# EAGLE board ArduSatPayloadModule (EAGLE 6.3), part 1 of 2
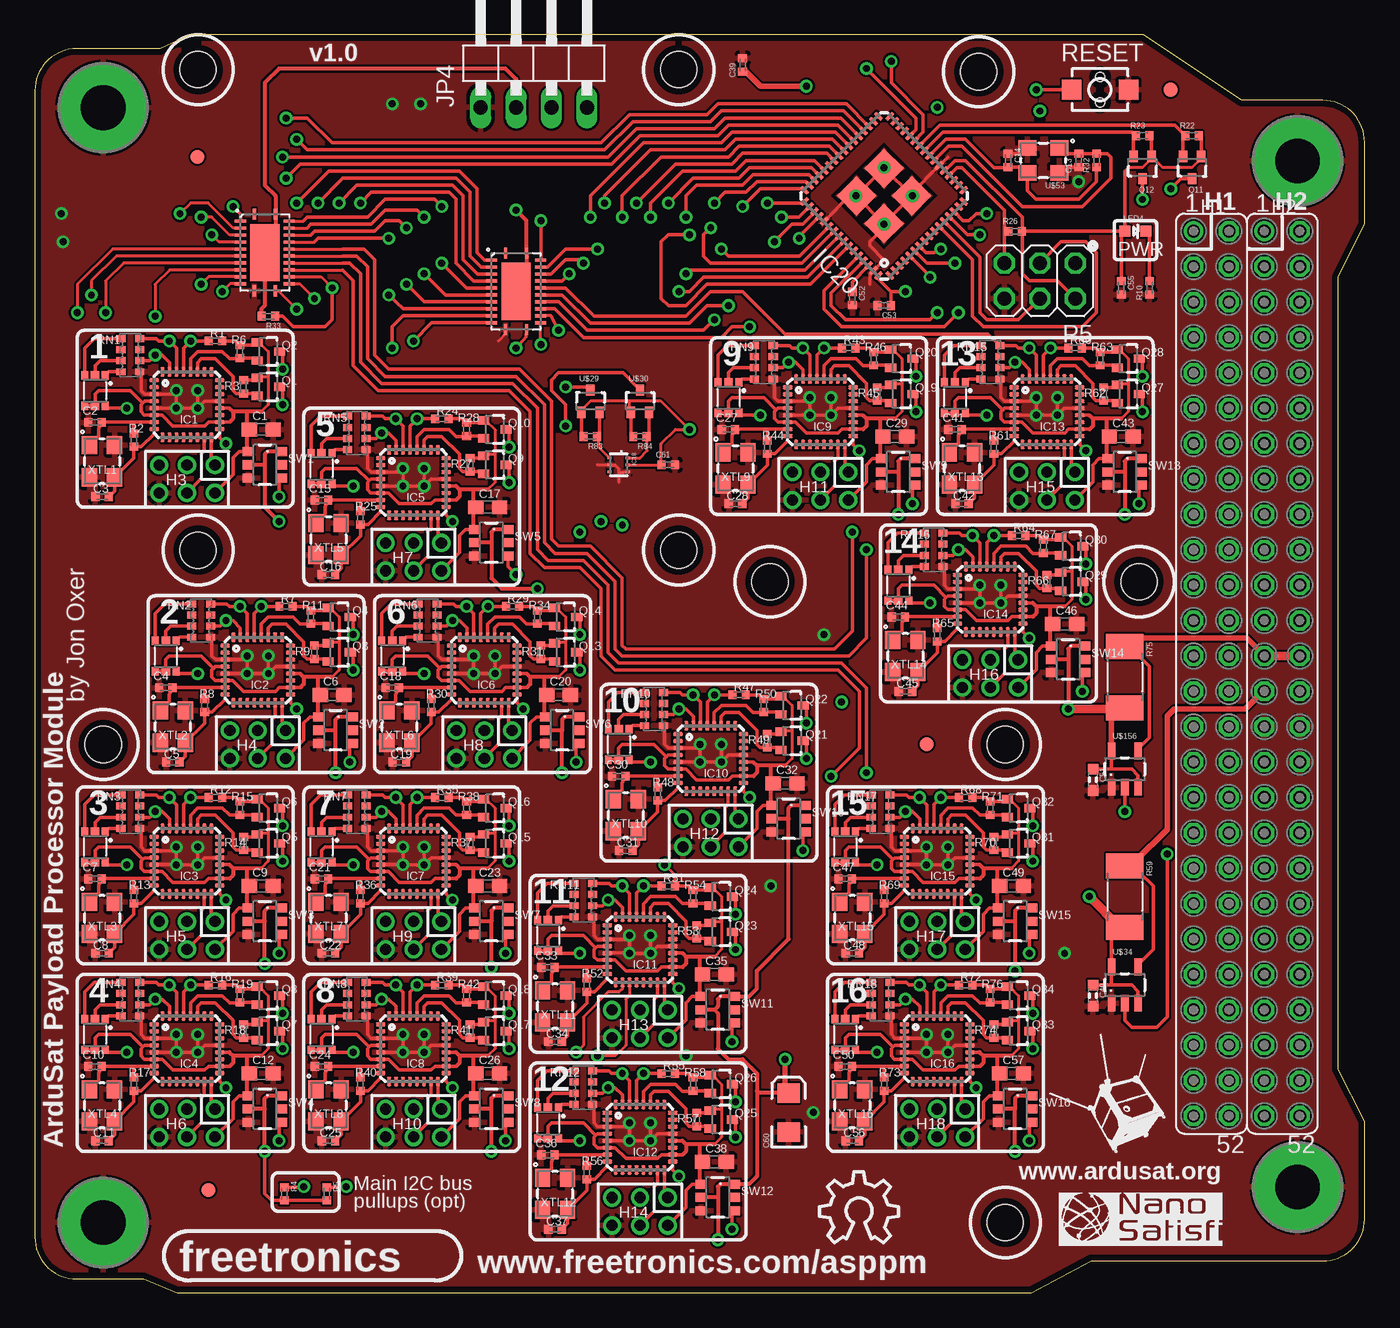
[diagram p19: board, top side]
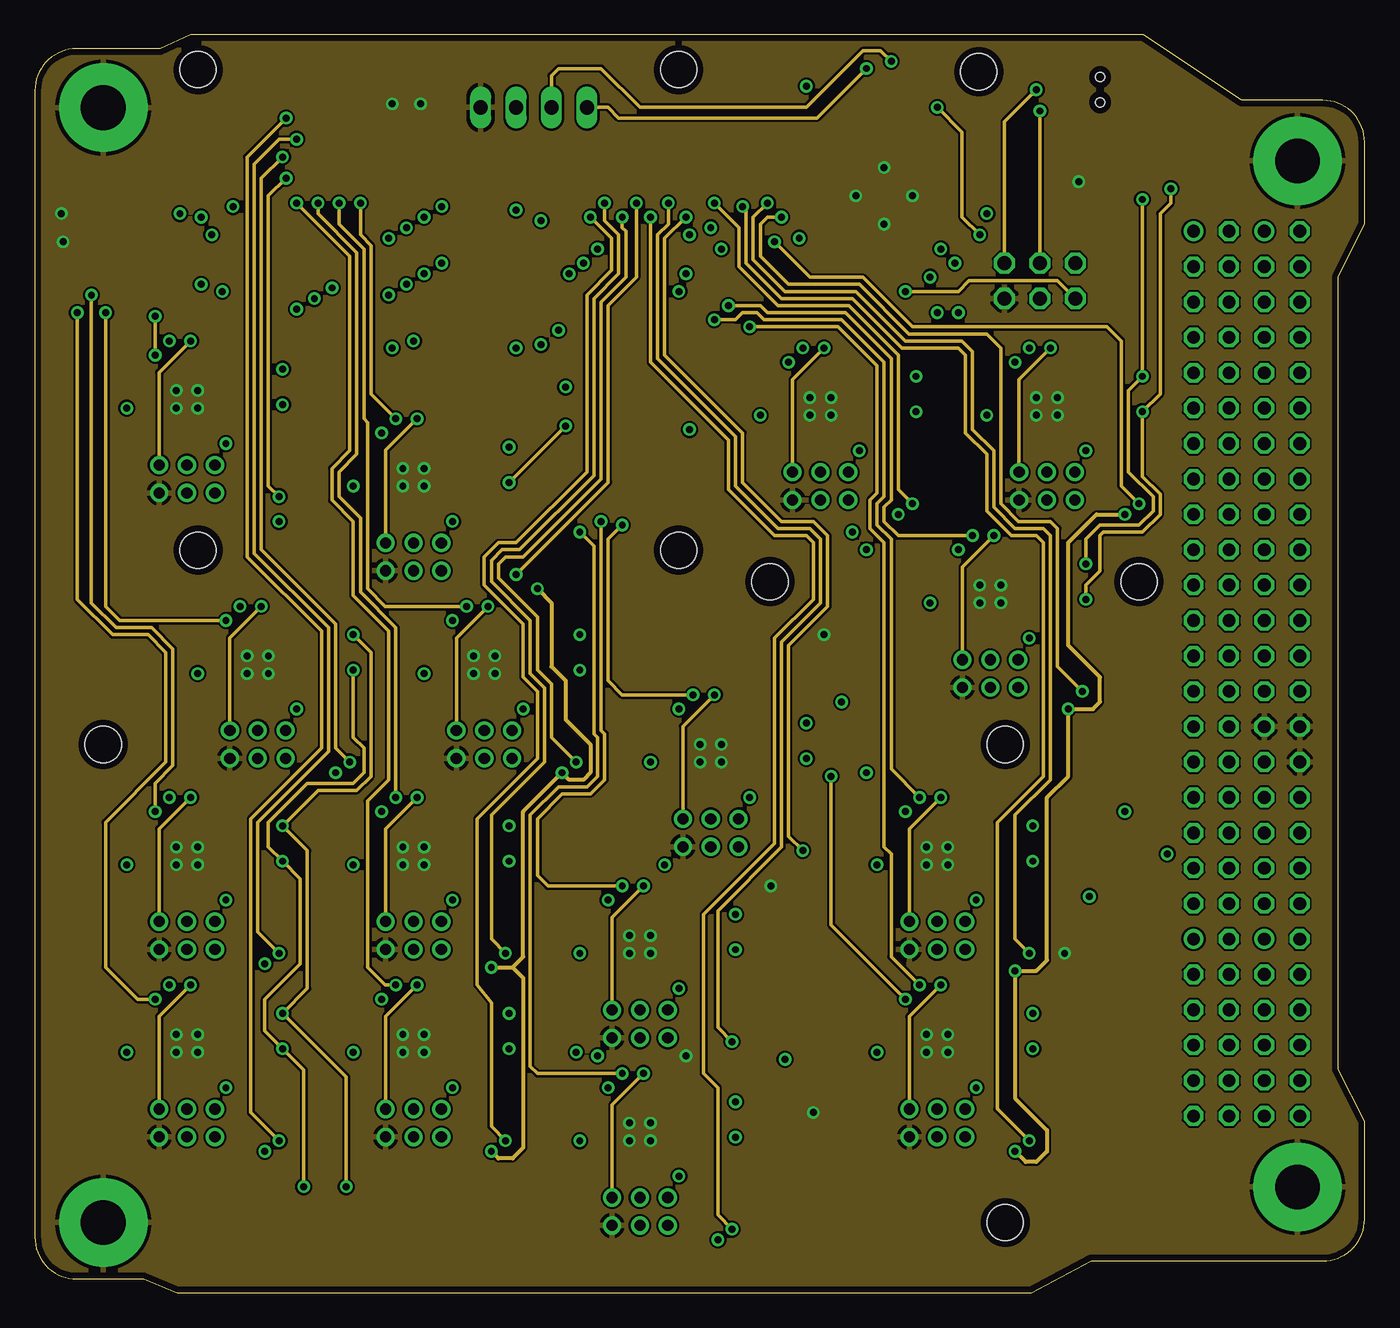
[diagram p20: board, inner layer Route2]
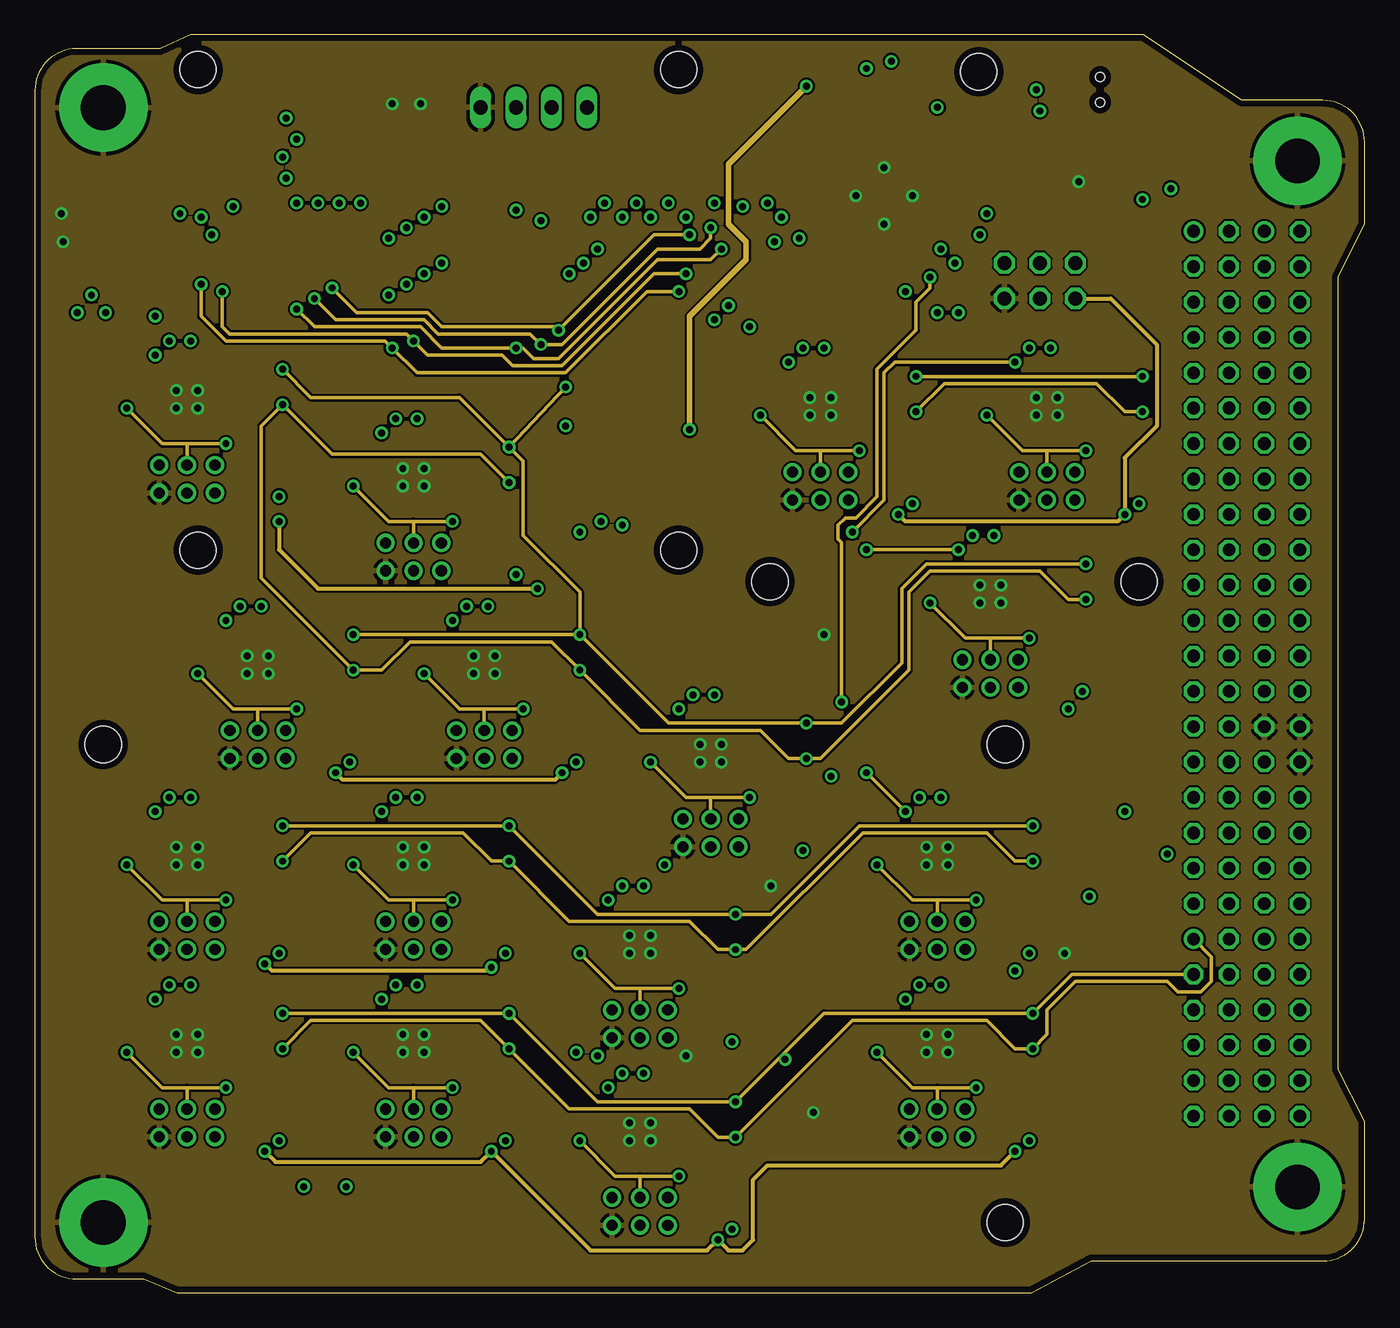
[diagram p21: board, inner layer Route15]
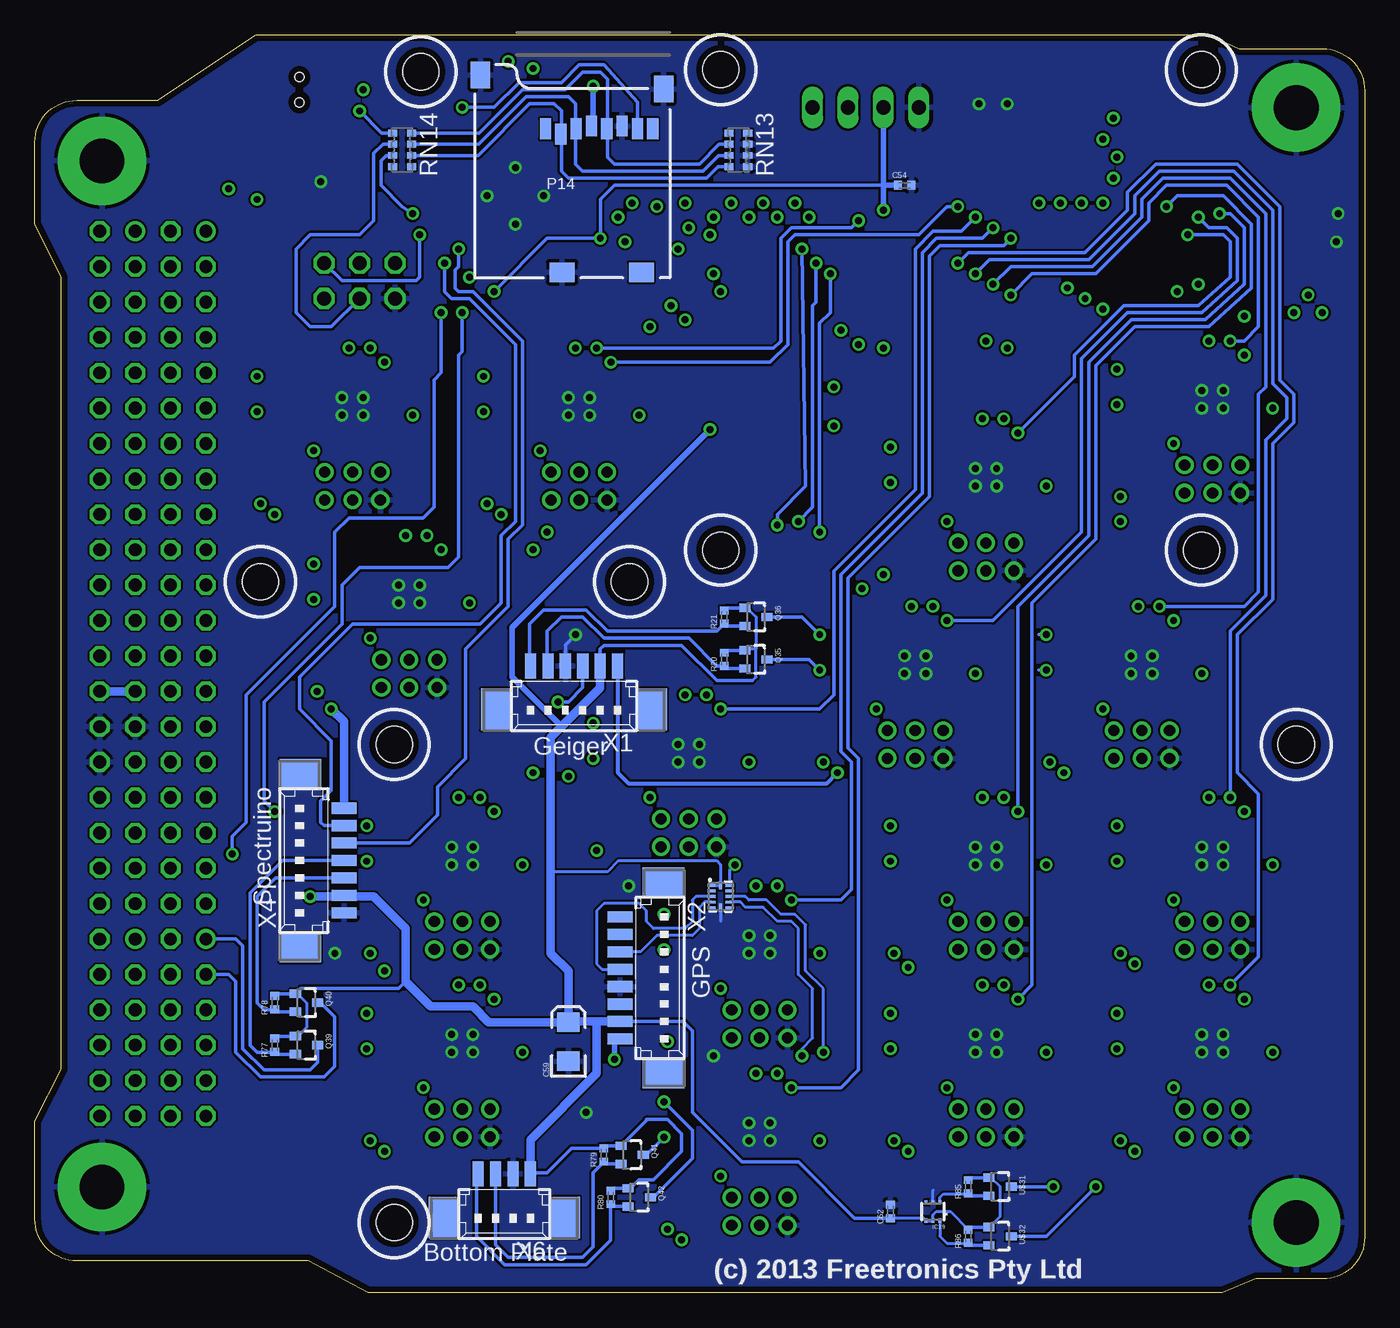
[diagram p22: board, bottom side, seen from below]

Size 95.45 x 90.3 mm. Coordinates in mm from the lower left corner, seen from the top.
Outline: 0,4 arc90 3,1 7.81,1 10.23,0 71.54,0 75.83,2.3 92.45,2.3 arc90 95.45,5.3 95.45,12.31 93.55,16.05 93.55,72.91 95.45,76.74 95.45,82.6 arc90 92.45,85.6 86.64,85.6 79.56,90.3 11.2,90.3 9,89.3 3,89.3 arc90 0,86.3 0,4
Copper layers (1+2*15+16): Top 0.035mm / dielectric 1.5mm / Route2 0.035mm / dielectric 0.15mm / Route15 0.035mm / dielectric 0.2mm / Bottom 0.035mm
Design rules "default *": minimum track width 6mil, minimum drill 24mil, track to track 6mil, track to pad 12mil, pad to pad 12mil, via to via 12mil, smd to smd 8mil, copper to edge 18mil, drill to drill 8mil, minimum pad ring 10mil, minimum via ring 8mil, stop-mask expansion 4mil, vias tented up to drill 0mil, thermal gap 10mil
Holes 2.6 mm at 11.72,87.8 46.21,87.8 67.75,87.65 11.72,53.31 46.21,53.31 52.76,51.05 79.26,51.05 69.65,39.37 4.91,39.37 69.65,5.05

## Footprints (pad centres in the part's own frame; a part is rotated, then mirrored left to right if it is on the bottom)
C0603 = smd 1.1 x 1: 1 -0.85,0; 2 0.85,0
0402C = smd 0.59 x 0.64: 1 -0.48,0; 2 0.48,0
0603 = smd 0.762 x 0.762: 1 -0.762,0; 2 0.762,0
EIA3216 = smd 1.4 x 1.6: A 1.4,0; C -1.4,0
FIDUCIAL-1X2.5 = smd 1 x 1: 1 0,0
CUBESATBUS = drill 0.914: 1 -31.75,-1.27; 41 19.05,-1.27 | drill 0.914 octagon: 2 -31.75,1.27; 3 -29.21,-1.27; 4 -29.21,1.27; 5 -26.67,-1.27; 6 -26.67,1.27; 7 -24.13,-1.27; 8 -24.13,1.27; 9 -21.59,-1.27; 10 -21.59,1.27; 11 -19.05,-1.27; 12 -19.05,1.27; 13 -16.51,-1.27; 14 -16.51,1.27; 15 -13.97,-1.27; 16 -13.97,1.27; 17 -11.43,-1.27; 18 -11.43,1.27; 19 -8.89,-1.27; 20 -8.89,1.27; 21 -6.35,-1.27; 22 -6.35,1.27; 23 -3.81,-1.27; 24 -3.81,1.27; 25 -1.27,-1.27; 26 -1.27,1.27; 27 1.27,-1.27; 28 1.27,1.27; 29 3.81,-1.27; 30 3.81,1.27; 31 6.35,-1.27; 32 6.35,1.27; 33 8.89,-1.27; 34 8.89,1.27; 35 11.43,-1.27; 36 11.43,1.27; 37 13.97,-1.27; 38 13.97,1.27; 39 16.51,-1.27; 40 16.51,1.27; 42 19.05,1.27; 43 21.59,-1.27; 44 21.59,1.27; 45 24.13,-1.27; 46 24.13,1.27; 47 26.67,-1.27; 48 26.67,1.27; 49 29.21,-1.27; 50 29.21,1.27; 51 31.75,-1.27; 52 31.75,1.27
M2X3-2MM = drill 0.8: 1 2,1; 2 2,-1; 3 0,1; 4 0,-1; 5 -2,1; 6 -2,-1
MLF32 = smd 0.7 x 0.3: 1 -2.35,1.75; 2 -2.35,1.25; 3 -2.35,0.75; 4 -2.35,0.25; 5 -2.35,-0.25; 6 -2.35,-0.75; 7 -2.35,-1.25; 8 -2.35,-1.75; 17 2.35,-1.75; 18 2.35,-1.25; 19 2.35,-0.75; 20 2.35,-0.25; 21 2.35,0.25; 22 2.35,0.75; 23 2.35,1.25; 24 2.35,1.75 | smd 0.3 x 0.7: 9 -1.75,-2.35; 10 -1.25,-2.35; 11 -0.75,-2.35; 12 -0.25,-2.35; 13 0.25,-2.35; 14 0.75,-2.35; 15 1.25,-2.35; 16 1.75,-2.35; 25 1.75,2.35; 26 1.25,2.35; 27 0.75,2.35; 28 0.25,2.35; 29 -0.25,2.35; 30 -0.75,2.35; 31 -1.25,2.35; 32 -1.75,2.35
SOT563 = smd 0.2 x 0.3: 1 -0.5,-0.65; 2 0,-0.65; 3 0.5,-0.65; 4 0.5,0.65; 5 0,0.65; 6 -0.5,0.65
MLF64 = smd 0.7 x 0.3: 1 -4.325,3.75; 2 -4.325,3.25; 3 -4.325,2.75; 4 -4.325,2.25; 5 -4.325,1.75; 6 -4.325,1.25; 7 -4.325,0.75; 8 -4.325,0.25; 9 -4.325,-0.25; 10 -4.325,-0.75; 11 -4.325,-1.25; 12 -4.325,-1.75; 13 -4.325,-2.25; 14 -4.325,-2.75; 15 -4.325,-3.25; 16 -4.325,-3.75; 33 4.325,-3.75; 34 4.325,-3.25; 35 4.325,-2.75; 36 4.325,-2.25; 37 4.325,-1.75; 38 4.325,-1.25; 39 4.325,-0.75; 40 4.325,-0.25; 41 4.325,0.25; 42 4.325,0.75; 43 4.325,1.25; 44 4.325,1.75; 45 4.325,2.25; 46 4.325,2.75; 47 4.325,3.25; 48 4.325,3.75 | smd 0.3 x 0.7: 17 -3.75,-4.325; 18 -3.25,-4.325; 19 -2.75,-4.325; 20 -2.25,-4.325; 21 -1.75,-4.325; 22 -1.25,-4.325; 23 -0.75,-4.325; 24 -0.25,-4.325; 25 0.25,-4.325; 26 0.75,-4.325; 27 1.25,-4.325; 28 1.75,-4.325; 29 2.25,-4.325; 30 2.75,-4.325; 31 3.25,-4.325; 32 3.75,-4.325; 49 3.75,4.325; 50 3.25,4.325; 51 2.75,4.325; 52 2.25,4.325; 53 1.75,4.325; 54 1.25,4.325; 55 0.75,4.325; 56 0.25,4.325; 57 -0.25,4.325; 58 -0.75,4.325; 59 -1.25,4.325; 60 -1.75,4.325; 61 -2.25,4.325; 62 -2.75,4.325; 63 -3.25,4.325; 64 -3.75,4.325 | smd 2 x 2: TGND1 -1.4,1.4; TGND2 -1.4,-1.4; TGND3 1.4,-1.4; TGND4 1.4,1.4
1X04/90 = drill 1.016 long: 1 -3.81,-3.81; 2 -1.27,-3.81; 3 1.27,-3.81; 4 3.81,-3.81
19-337 = smd 0.6 x 0.5: 1 -1.1,0.75; 3 -1.1,-0.75; 4 1.1,0.75; 6 1.1,-0.75 | smd 0.6 x 0.6: 2 -1.1,0; 5 1.1,0
LED-0603 = smd 0.8 x 0.8: A 0,-0.75; C 0,0.75
HOLE32 = drill 3.2 pad 6.35: P$1 0,0
2X03PTH = drill 1.016 octagon: 1 -2.54,-1.27; 2 -2.54,1.27; 3 0,-1.27; 4 0,1.27; 5 2.54,-1.27; 6 2.54,1.27
MICRO-SD-SOCKET-PP = smd 0.8 x 1.5: 1 -8.94,10.7; 2 -7.84,10.3; 3 -6.74,10.7; 4 -5.64,10.9; 5 -4.54,10.7; 6 -3.44,10.9; 7 -2.34,10.7; 8 -1.24,10.7 | smd 1.8 x 1.4: CD1 -2.05,0.4; CD2 -7.75,0.4 | smd 1.4 x 1.9: GND1 -0.45,13.55; GND2 -13.6,14.55
SOT32-3 = smd 0.6 x 0.8: 1 -0.65,-0.8; 2 0.65,-0.8; 3 0,0.8
0402 = smd 0.571 x 0.62: 1 -0.48,0; 2 0.48,0
R2010 = smd 1.8 x 2.7: 1 -2.2,0; 2 2.2,0
CAY16 = smd 0.5 x 0.65: 1 -1.2,-0.675; 2 -0.4,-0.675; 3 0.4,-0.675; 4 1.2,-0.675; 5 1.2,0.675; 6 0.4,0.675; 7 -0.4,0.675; 8 -1.2,0.675
TACTILE_SWITCH_SMD_2PIN_TINY = smd 1.4 x 1.4: 1 -2.05,0; 2 2.05,0 | hole 0.65: 0,0.9; 0,-0.9
SOT23-6 = smd 0.65 x 0.8: 1 -0.95,-1.2; 2 0,-1.2; 3 0.95,-1.2; 4 0.95,1.2; 5 0,1.2; 6 -0.95,1.2
QFN-12 = smd 0.2 x 0.6: 1 -0.8,-0.65; 2 -0.4,-0.65; 3 0,-0.65; 4 0.4,-0.65; 5 0.8,-0.65; 7 0.8,0.65; 8 0.4,0.65; 9 0,0.65; 10 -0.4,0.65; 11 -0.8,0.65 | smd 0.6 x 0.2: 6 0.8,0; 12 -0.8,0
SOT23-5 = smd 0.55 x 1.2: 1 -0.95,-1.3; 2 0,-1.3; 3 0.95,-1.3; 4 0.95,1.3; 5 -0.95,1.3
CRYSTAL-SMD-3X2 = smd 1.3 x 1.1: 1 -1.15,-0.9; 2 1.15,-0.9; 3 1.15,0.9; 4 -1.15,0.9
DHVQFN24 = smd 0.8 x 0.23: 1 -2.75,-0.75; 12 2.75,-0.75; 13 2.75,0.75; 24 -2.75,0.75 | smd 0.24 x 0.8: 2 -2.25,-1.75 | smd 0.23 x 0.8: 3 -1.75,-1.75; 4 -1.25,-1.75; 5 -0.75,-1.75; 6 -0.25,-1.75; 7 0.25,-1.75; 8 0.75,-1.75; 9 1.25,-1.75; 10 1.75,-1.75; 11 2.25,-1.75; 14 2.25,1.75; 15 1.75,1.75; 16 1.25,1.75; 17 0.75,1.75; 18 0.25,1.75; 19 -0.25,1.75; 20 -0.75,1.75; 21 -1.25,1.75; 22 -1.75,1.75; 23 -2.25,1.75 | smd 4.1 x 2.1: 25 0,0
53398-06 = smd 0.8 x 1.8: 1 3.125,-2.5; 2 1.875,-2.5; 3 0.625,-2.5; 4 -0.625,-2.5; 5 -1.875,-2.5; 6 -3.125,-2.5 | smd 2.1 x 3: S1 5.625,0.625; S2 -5.625,0.625
53398-08 = smd 0.8 x 1.8: 1 4.375,-2.5; 2 3.125,-2.5; 3 1.875,-2.5; 4 0.625,-2.5; 5 -0.625,-2.5; 6 -1.875,-2.5; 7 -3.125,-2.5; 8 -4.375,-2.5 | smd 2.1 x 3: S1 6.875,0.625; S2 -6.875,0.625
53398-07 = smd 0.8 x 1.8: 1 3.75,-2.5; 2 2.5,-2.5; 3 1.25,-2.5; 4 0,-2.5; 5 -1.25,-2.5; 6 -2.5,-2.5; 7 -3.75,-2.5 | smd 2.1 x 3: S1 6.25,0.625; S2 -6.25,0.625
53398-04 = smd 0.8 x 1.8: 1 1.875,-2.5; 2 0.625,-2.5; 3 -0.625,-2.5; 4 -1.875,-2.5 | smd 2.1 x 3: S1 4.375,0.625; S2 -4.375,0.625

## Placement (x,y rotation side)
C1  1uF 0603  [C0603]  16.26,61.98 0 top
C2  22pF 0402  [0402C]  4.32,62.48 0 top
C3  22pF 0402  [0402C]  4.83,57.15 0 top
C4  22pF 0402  [0402C]  9.4,43.43 0 top
C5  22pF 0402  [0402C]  9.91,38.1 0 top
C6  1uF 0603  [C0603]  21.34,42.93 0 top
C7  22pF 0402  [0402C]  4.32,29.72 0 top
C8  22pF 0402  [0402C]  4.83,24.38 0 top
C9  1uF 0603  [C0603]  16.26,29.21 0 top
C10  22pF 0402  [0402C]  4.32,16.26 0 top
C11  22pF 0402  [0402C]  4.83,10.92 0 top
C12  1uF 0603  [C0603]  16.26,15.75 0 top
C13  22pF 0603  [0402C]  74.93,81.28 90 top
C14  22pF 0603  [0402C]  69.85,81.28 270 top
C15  22pF 0402  [0402C]  20.57,56.9 0 top
C16  22pF 0402  [0402C]  21.08,51.56 0 top
C17  1uF 0603  [C0603]  32.51,56.39 0 top
C18  22pF 0402  [0402C]  25.65,43.43 0 top
C19  22pF 0402  [0402C]  26.16,38.1 0 top
C20  1uF 0603  [C0603]  37.59,42.93 0 top
C21  22pF 0402  [0402C]  20.57,29.72 0 top
C22  22pF 0402  [0402C]  21.08,24.38 0 top
C23  1uF 0603  [C0603]  32.51,29.21 0 top
C24  22pF 0402  [0402C]  20.57,16.26 0 top
C25  22pF 0402  [0402C]  21.08,10.92 0 top
C26  1uF 0603  [C0603]  32.51,15.75 0 top
C27  22pF 0402  [0402C]  49.78,61.98 0 top
C28  22pF 0402  [0402C]  50.29,56.64 0 top
C29  1uF 0603  [C0603]  61.72,61.47 0 top
C30  22pF 0402  [0402C]  41.91,37.08 0 top
C31  22pF 0402  [0402C]  42.42,31.75 0 top
C32  1uF 0603  [C0603]  53.85,36.58 0 top
C33  22pF 0402  [0402C]  36.83,23.37 0 top
C34  22pF 0402  [0402C]  37.34,18.03 0 top
C35  1uF 0603  [C0603]  48.77,22.86 0 top
C36  22pF 0402  [0402C]  36.83,9.91 0 top
C37  22pF 0402  [0402C]  37.34,4.57 0 top
C38  1uF 0603  [C0603]  48.77,9.4 0 top
C39  100nF 0402  [0402C]  50.8,88.14 90 top
C40  100nF 0402  [0603]  75.95,21.34 270 top
C41  22pF 0402  [0402C]  66.04,61.98 0 top
C42  22pF 0402  [0402C]  66.55,56.64 0 top
C43  1uF 0603  [C0603]  77.98,61.47 0 top
C44  22pF 0402  [0402C]  61.98,48.51 0 top
C45  22pF 0402  [0402C]  62.48,43.18 0 top
C46  1uF 0603  [C0603]  73.91,48.01 0 top
C47  22pF 0402  [0402C]  58.17,29.72 0 top
C48  22pF 0402  [0402C]  58.67,24.38 0 top
C49  1uF 0603  [C0603]  70.1,29.21 0 top
C50  22pF 0402  [0402C]  58.17,16.26 0 top
C51  100nF 0402  [0603]  75.95,36.83 270 top
C52  100nF  [0402C]  58.67,71.37 270 top
C53  100nF  [0402C]  60.96,70.87 180 top
C54  100nF  [0402C]  33.02,79.5 0 bottom
C55  100nF  [0402C]  77.98,72.14 270 top
C56  22pF 0402  [0402C]  58.67,10.92 0 top
C57  1uF 0603  [C0603]  70.1,15.75 0 top
C59  10uF 10V A TANT  [EIA3216]  57.15,18.03 90 bottom
C60  10uF 10V A TANT  [EIA3216]  54.1,12.95 90 top
C61  100nF 0402  [0402C]  45.47,59.44 0 top
C62  100nF 0402  [0402C]  34.04,5.84 90 bottom
FID1  FIDUCIAL1X2.5  [FIDUCIAL-1X2.5]  81.53,86.36 0 top
FID2  FIDUCIAL1X2.5  [FIDUCIAL-1X2.5]  11.68,81.53 0 top
FID3  FIDUCIAL1X2.5  [FIDUCIAL-1X2.5]  64.01,39.37 0 top
FID4  FIDUCIAL1X2.5  [FIDUCIAL-1X2.5]  12.45,7.37 0 top
H1  CUBESATBUSH  [CUBESATBUS]  84.44,44.45 270 top
H2  CUBESATBUSH  [CUBESATBUS]  89.52,44.45 270 top
H3  ICSP  [M2X3-2MM]  10.92,58.42 0 top
H4  ICSP  [M2X3-2MM]  16,39.37 0 top
H5  ICSP  [M2X3-2MM]  10.92,25.65 0 top
H6  ICSP  [M2X3-2MM]  10.92,12.19 0 top
H7  ICSP  [M2X3-2MM]  27.18,52.83 0 top
H8  ICSP  [M2X3-2MM]  32.26,39.37 0 top
H9  ICSP  [M2X3-2MM]  27.18,25.65 0 top
H10  ICSP  [M2X3-2MM]  27.18,12.19 0 top
H11  ICSP  [M2X3-2MM]  56.39,57.91 0 top
H12  ICSP  [M2X3-2MM]  48.51,33.02 0 top
H13  ICSP  [M2X3-2MM]  43.43,19.3 0 top
H14  ICSP  [M2X3-2MM]  43.43,5.84 0 top
H15  ICSP  [M2X3-2MM]  72.64,57.91 0 top
H16  ICSP  [M2X3-2MM]  68.58,44.45 0 top
H17  ICSP  [M2X3-2MM]  64.77,25.65 0 top
H18  ICSP  [M2X3-2MM]  64.77,12.19 0 top
IC1  ATMEGA328P QFN32  [MLF32]  10.92,63.75 0 top
IC2  ATMEGA328P QFN32  [MLF32]  16,44.7 0 top
IC3  ATMEGA328P QFN32  [MLF32]  10.92,30.99 0 top
IC4  ATMEGA328P QFN32  [MLF32]  10.92,17.53 0 top
IC5  ATMEGA328P QFN32  [MLF32]  27.18,58.17 0 top
IC6  ATMEGA328P QFN32  [MLF32]  32.26,44.7 0 top
IC7  ATMEGA328P QFN32  [MLF32]  27.18,30.99 0 top
IC8  ATMEGA328P QFN32  [MLF32]  27.18,17.53 0 top
IC9  ATMEGA328P QFN32  [MLF32]  56.39,63.25 0 top
IC10  ATMEGA328P QFN32  [MLF32]  48.51,38.35 0 top
IC11  ATMEGA328P QFN32  [MLF32]  43.43,24.64 0 top
IC12  ATMEGA328P QFN32  [MLF32]  43.43,11.18 0 top
IC13  ATMEGA328P QFN32  [MLF32]  72.64,63.25 0 top
IC14  ATMEGA328P QFN32  [MLF32]  68.58,49.78 0 top
IC15  ATMEGA328P QFN32  [MLF32]  64.77,30.99 0 top
IC16  ATMEGA328P QFN32  [MLF32]  64.77,17.53 0 top
IC18  TMP102  [SOT563]  41.91,59.44 270 top
IC19  TMP102  [SOT563]  30.99,5.84 180 bottom
IC20  ATMEGA2561-16MU  [MLF64]  60.96,78.74 135 top
JP4  [1X04/90]  35.81,88.9 0 top
LED1  RGBLEDSMT  [19-337]  4.32,64.77 270 top
LED2  RGBLEDSMT  [19-337]  9.4,45.72 270 top
LED3  RGBLEDSMT  [19-337]  4.32,32 270 top
LED4  PWR/BLUE  [LED-0603]  78.99,76.2 270 top
LED5  RGBLEDSMT  [19-337]  4.32,18.54 270 top
LED6  RGBLEDSMT  [19-337]  20.57,59.18 270 top
LED7  RGBLEDSMT  [19-337]  25.65,45.72 270 top
LED8  RGBLEDSMT  [19-337]  20.57,32 270 top
LED9  RGBLEDSMT  [19-337]  20.57,18.54 270 top
LED10  RGBLEDSMT  [19-337]  49.78,64.26 270 top
LED11  RGBLEDSMT  [19-337]  41.91,39.37 270 top
LED12  RGBLEDSMT  [19-337]  36.83,25.65 270 top
LED13  RGBLEDSMT  [19-337]  36.83,12.19 270 top
LED14  RGBLEDSMT  [19-337]  66.04,64.26 270 top
LED15  RGBLEDSMT  [19-337]  61.98,50.8 270 top
LED16  RGBLEDSMT  [19-337]  58.17,32 270 top
LED17  RGBLEDSMT  [19-337]  58.17,18.54 270 top
MNT1  HOLE3.2MM  [HOLE32]  4.91,85.07 0 top
MNT2  HOLE3.2MM  [HOLE32]  90.63,81.26 0 top
MNT3  HOLE3.2MM  [HOLE32]  4.91,5.05 0 top
MNT4  HOLE3.2MM  [HOLE32]  90.63,7.6 0 top
P5  S_ICSP  [2X03PTH]  72.14,72.64 180 top
P14  microSD  [MICRO-SD-SOCKET-PP]  49.86,72.86 0 bottom
Q1  RJU003N03 N-MOSFET  [SOT32-3]  16.76,65.02 270 top
Q2  RJU003N03 N-MOSFET  [SOT32-3]  16.76,67.56 270 top
Q3  RJU003N03 N-MOSFET  [SOT32-3]  21.84,45.97 270 top
Q4  RJU003N03 N-MOSFET  [SOT32-3]  21.84,48.51 270 top
Q5  RJU003N03 N-MOSFET  [SOT32-3]  16.76,32.26 270 top
Q6  RJU003N03 N-MOSFET  [SOT32-3]  16.76,34.8 270 top
Q7  RJU003N03 N-MOSFET  [SOT32-3]  16.76,18.8 270 top
Q8  RJU003N03 N-MOSFET  [SOT32-3]  16.76,21.34 270 top
Q9  RJU003N03 N-MOSFET  [SOT32-3]  33.02,59.44 270 top
Q10  RJU003N03 N-MOSFET  [SOT32-3]  33.02,61.98 270 top
Q11  RJU003N03 N-MOSFET  [SOT32-3]  83.06,80.77 180 top
Q12  RJU003N03 N-MOSFET  [SOT32-3]  79.5,80.77 180 top
Q13  RJU003N03 N-MOSFET  [SOT32-3]  38.1,45.97 270 top
Q14  RJU003N03 N-MOSFET  [SOT32-3]  38.1,48.51 270 top
Q15  RJU003N03 N-MOSFET  [SOT32-3]  33.02,32.26 270 top
Q16  RJU003N03 N-MOSFET  [SOT32-3]  33.02,34.8 270 top
Q17  RJU003N03 N-MOSFET  [SOT32-3]  33.02,18.8 270 top
Q18  RJU003N03 N-MOSFET  [SOT32-3]  33.02,21.34 270 top
Q19  RJU003N03 N-MOSFET  [SOT32-3]  62.23,64.52 270 top
Q20  RJU003N03 N-MOSFET  [SOT32-3]  62.23,67.06 270 top
Q21  RJU003N03 N-MOSFET  [SOT32-3]  54.36,39.62 270 top
Q22  RJU003N03 N-MOSFET  [SOT32-3]  54.36,42.16 270 top
Q23  RJU003N03 N-MOSFET  [SOT32-3]  49.28,25.91 270 top
Q24  RJU003N03 N-MOSFET  [SOT32-3]  49.28,28.45 270 top
Q25  RJU003N03 N-MOSFET  [SOT32-3]  49.28,12.45 270 top
Q26  RJU003N03 N-MOSFET  [SOT32-3]  49.28,14.99 270 top
Q27  RJU003N03 N-MOSFET  [SOT32-3]  78.49,64.52 270 top
Q28  RJU003N03 N-MOSFET  [SOT32-3]  78.49,67.06 270 top
Q29  RJU003N03 N-MOSFET  [SOT32-3]  74.42,51.05 270 top
Q30  RJU003N03 N-MOSFET  [SOT32-3]  74.42,53.59 270 top
Q31  RJU003N03 N-MOSFET  [SOT32-3]  70.61,32.26 270 top
Q32  RJU003N03 N-MOSFET  [SOT32-3]  70.61,34.8 270 top
Q33  RJU003N03 N-MOSFET  [SOT32-3]  70.61,18.8 270 top
Q34  RJU003N03 N-MOSFET  [SOT32-3]  70.61,21.34 270 top
Q35  RJU003N03 N-MOSFET  [SOT32-3]  43.69,45.47 270 bottom
Q36  RJU003N03 N-MOSFET  [SOT32-3]  43.69,48.51 270 bottom
Q39  RJU003N03 N-MOSFET  [SOT32-3]  75.95,17.78 270 bottom
Q40  RJU003N03 N-MOSFET  [SOT32-3]  75.95,20.83 270 bottom
Q41  RJU003N03 N-MOSFET  [SOT32-3]  52.58,9.91 270 bottom
Q42  RJU003N03 N-MOSFET  [SOT32-3]  52.07,6.86 270 bottom
R1  22K 0402  [0402]  12.95,68.33 0 top
R2  1M 0402  [0402]  7.11,61.21 90 top
R3  10K 0402  [0402]  14.99,65.02 90 top
R4  10K 0402  [0402]  17.91,7.11 270 top
R5  10K 0402  [0402]  20.95,7.11 270 top
R6  10K 0402  [0402]  14.73,67.56 90 top
R7  22K 0402  [0402]  18.03,49.28 0 top
R8  1M 0402  [0402]  12.19,42.16 90 top
R9  10K 0402  [0402]  20.07,45.97 90 top
R10  2K2 0402  [0402]  80.01,72.14 90 top
R11  10K 0402  [0402]  19.81,48.51 90 top
R12  22K 0402  [0402]  12.95,35.56 0 top
R13  1M 0402  [0402]  7.11,28.45 90 top
R14  10K 0402  [0402]  14.99,32.26 90 top
R15  10K 0402  [0402]  14.73,34.8 90 top
R16  22K 0402  [0402]  12.95,22.1 0 top
R17  1M 0402  [0402]  7.11,14.99 90 top
R18  10K 0402  [0402]  14.99,18.8 90 top
R19  10K 0402  [0402]  14.73,21.34 90 top
R20  4K7 0402  [0402]  45.97,45.47 90 bottom
R21  4K7 0402  [0402]  45.97,48.51 90 bottom
R22  10K 0402  [0402]  83.06,83.06 0 top
R23  10K 0402  [0402]  79.5,83.06 0 top
R24  22K 0402  [0402]  29.21,62.74 0 top
R25  1M 0402  [0402]  23.37,55.63 90 top
R26  22K 0603  [0402]  70.36,76.2 0 top
R27  10K 0402  [0402]  31.24,59.44 90 top
R28  10K 0402  [0402]  30.99,61.98 90 top
R29  22K 0402  [0402]  34.29,49.28 0 top
R30  1M 0402  [0402]  28.45,42.16 90 top
R31  10K 0402  [0402]  36.32,45.97 90 top
R32  1M 0402  [0402]  76.2,81.28 90 top
R33  33K 0402  [0402]  16.76,70.1 180 top
R34  10K 0402  [0402]  36.07,48.51 90 top
R35  22K 0402  [0402]  29.21,35.56 0 top
R36  1M 0402  [0402]  23.37,28.45 90 top
R37  10K 0402  [0402]  31.24,32.26 90 top
R38  10K 0402  [0402]  30.99,34.8 90 top
R39  22K 0402  [0402]  29.21,22.1 0 top
R40  1M 0402  [0402]  23.37,14.99 90 top
R41  10K 0402  [0402]  31.24,18.8 90 top
R42  10K 0402  [0402]  30.99,21.34 90 top
R43  22K 0402  [0402]  58.42,67.82 0 top
R44  1M 0402  [0402]  52.58,60.71 90 top
R45  10K 0402  [0402]  60.45,64.52 90 top
R46  10K 0402  [0402]  60.2,67.06 90 top
R47  22K 0402  [0402]  50.55,42.93 0 top
R48  1M 0402  [0402]  44.7,35.81 90 top
R49  10K 0402  [0402]  52.58,39.62 90 top
R50  10K 0402  [0402]  52.32,42.16 90 top
R51  22K 0402  [0402]  45.47,29.21 0 top
R52  1M 0402  [0402]  39.62,22.1 90 top
R53  10K 0402  [0402]  47.5,25.91 90 top
R54  10K 0402  [0402]  47.24,28.45 90 top
R55  22K 0402  [0402]  45.47,15.75 0 top
R56  1M 0402  [0402]  39.62,8.64 90 top
R57  10K 0402  [0402]  47.5,12.45 90 top
R58  10K 0402  [0402]  47.24,14.99 90 top
R59  0.15R 2010  [R2010]  78.23,28.45 270 top
R60  22K 0402  [0402]  74.68,67.82 0 top
R61  1M 0402  [0402]  68.83,60.71 90 top
R62  10K 0402  [0402]  76.71,64.52 90 top
R63  10K 0402  [0402]  76.45,67.06 90 top
R64  22K 0402  [0402]  70.61,54.36 0 top
R65  1M 0402  [0402]  64.77,47.24 90 top
R66  10K 0402  [0402]  72.64,51.05 90 top
R67  10K 0402  [0402]  72.39,53.59 90 top
R68  22K 0402  [0402]  66.8,35.56 0 top
R69  1M 0402  [0402]  60.96,28.45 90 top
R70  10K 0402  [0402]  68.83,32.26 90 top
R71  10K 0402  [0402]  68.58,34.8 90 top
R72  22K 0402  [0402]  66.8,22.1 0 top
R73  1M 0402  [0402]  60.96,14.99 90 top
R74  10K 0402  [0402]  68.83,18.8 90 top
R75  0.15R 2010  [R2010]  78.23,44.2 270 top
R76  10K 0402  [0402]  68.58,21.34 90 top
R77  4K7 0402  [0402]  78.23,17.78 90 bottom
R78  4K7 0402  [0402]  78.23,20.83 90 bottom
R79  4K7 0402  [0402]  54.61,9.91 90 bottom
R80  4K7 0402  [0402]  54.1,6.86 90 bottom
R83  10K 0402  [0402]  39.88,61.47 180 top
R84  10K 0402  [0402]  43.43,61.47 180 top
R85  10K 0402  [0402]  28.45,7.62 90 bottom
R86  10K 0402  [0402]  28.45,4.06 90 bottom
RN1  2K2  [CAY16]  6.86,67.31 90 top
RN2  2K2  [CAY16]  11.94,48.26 90 top
RN3  2K2  [CAY16]  6.86,34.54 90 top
RN4  2K2  [CAY16]  6.86,21.08 90 top
RN5  2K2  [CAY16]  23.11,61.72 90 top
RN6  2K2  [CAY16]  28.19,48.26 90 top
RN7  2K2  [CAY16]  23.11,34.54 90 top
RN8  2K2  [CAY16]  23.11,21.08 90 top
RN9  2K2  [CAY16]  52.32,66.8 90 top
RN10  2K2  [CAY16]  44.45,41.91 90 top
RN11  2K2  [CAY16]  39.37,28.19 90 top
RN12  2K2  [CAY16]  39.37,14.73 90 top
RN13  2K2  [CAY16]  44.96,82.04 90 bottom
RN14  1K  [CAY16]  69.09,82.04 90 bottom
RN15  2K2  [CAY16]  68.58,66.8 90 top
RN16  2K2  [CAY16]  64.52,53.34 90 top
RN17  2K2  [CAY16]  60.71,34.54 90 top
RN18  2K2  [CAY16]  60.71,21.08 90 top
S1  RESET  [TACTILE_SWITCH_SMD_2PIN_TINY]  76.45,86.36 180 top
SW1  ADG801SOT23-6  [SOT23-6]  16.51,59.44 270 top
SW2  ADG801SOT23-6  [SOT23-6]  21.59,40.39 270 top
SW3  ADG801SOT23-6  [SOT23-6]  16.51,26.67 270 top
SW4  ADG801SOT23-6  [SOT23-6]  16.51,13.21 270 top
SW5  ADG801SOT23-6  [SOT23-6]  32.77,53.85 270 top
SW6  ADG801SOT23-6  [SOT23-6]  37.85,40.39 270 top
SW7  ADG801SOT23-6  [SOT23-6]  32.77,26.67 270 top
SW8  ADG801SOT23-6  [SOT23-6]  32.77,13.21 270 top
SW9  ADG801SOT23-6  [SOT23-6]  61.98,58.93 270 top
SW10  ADG801SOT23-6  [SOT23-6]  54.1,34.04 270 top
SW11  ADG801SOT23-6  [SOT23-6]  49.02,20.32 270 top
SW12  ADG801SOT23-6  [SOT23-6]  49.02,6.86 270 top
SW13  ADG801SOT23-6  [SOT23-6]  78.23,58.93 270 top
SW14  ADG801SOT23-6  [SOT23-6]  74.17,45.47 270 top
SW15  ADG801SOT23-6  [SOT23-6]  70.36,26.67 270 top
SW16  ADG801SOT23-6  [SOT23-6]  70.36,13.21 270 top
U$26  TXB0104  [QFN-12]  46.23,28.45 270 bottom
U$29  MOSFET-NSOT-323  [SOT32-3]  39.88,64.01 0 top
U$30  MOSFET-NSOT-323  [SOT32-3]  43.43,64.01 0 top
U$31  MOSFET-NSOT-323  [SOT32-3]  26.16,7.62 270 bottom
U$32  MOSFET-NSOT-323  [SOT32-3]  26.16,4.06 270 bottom
U$33  [OSHW_10X200_NOTEXT]  56.32,3.61 0 top
U$34  MAX4372  [SOT23-5]  78.23,22.1 0 top
U$53  CRYSTAL-GND3X2  [CRYSTAL-SMD-3X2]  72.39,81.28 180 top
U$59  MUX-74HC4067-QFNSMT  [DHVQFN24]  34.54,71.88 270 top
U$60  MUX-74HC4067-QFNSMT  [DHVQFN24]  16.51,74.68 270 top
U$156  MAX4372  [SOT23-5]  78.23,37.59 0 top
X1  geiger  [53398-06]  56.75,42.51 180 bottom
X2  gps  [53398-08]  50.96,22.61 270 bottom
X4  spectruino  [53398-07]  75.76,31.04 90 bottom
X6  53398-04  [53398-04]  61.76,6.04 180 bottom
XTL1  SMD3225-16MHZ 3.2 x 2.5mm crystal  [CRYSTAL-SMD-3X2]  4.83,59.69 270 top
XTL2  SMD3225-16MHZ 3.2 x 2.5mm crystal  [CRYSTAL-SMD-3X2]  9.91,40.64 270 top
XTL3  SMD3225-16MHZ 3.2 x 2.5mm crystal  [CRYSTAL-SMD-3X2]  4.83,26.92 270 top
XTL4  SMD3225-16MHZ 3.2 x 2.5mm crystal  [CRYSTAL-SMD-3X2]  4.83,13.46 270 top
XTL5  SMD3225-16MHZ 3.2 x 2.5mm crystal  [CRYSTAL-SMD-3X2]  21.08,54.1 270 top
XTL6  SMD3225-16MHZ 3.2 x 2.5mm crystal  [CRYSTAL-SMD-3X2]  26.16,40.64 270 top
XTL7  SMD3225-16MHZ 3.2 x 2.5mm crystal  [CRYSTAL-SMD-3X2]  21.08,26.92 270 top
XTL8  SMD3225-16MHZ 3.2 x 2.5mm crystal  [CRYSTAL-SMD-3X2]  21.08,13.46 270 top
XTL9  SMD3225-16MHZ 3.2 x 2.5mm crystal  [CRYSTAL-SMD-3X2]  50.29,59.18 270 top
XTL10  SMD3225-16MHZ 3.2 x 2.5mm crystal  [CRYSTAL-SMD-3X2]  42.42,34.29 270 top
XTL11  SMD3225-16MHZ 3.2 x 2.5mm crystal  [CRYSTAL-SMD-3X2]  37.34,20.57 270 top
XTL12  SMD3225-16MHZ 3.2 x 2.5mm crystal  [CRYSTAL-SMD-3X2]  37.34,7.11 270 top
XTL13  SMD3225-16MHZ 3.2 x 2.5mm crystal  [CRYSTAL-SMD-3X2]  66.55,59.18 270 top
XTL14  SMD3225-16MHZ 3.2 x 2.5mm crystal  [CRYSTAL-SMD-3X2]  62.48,45.72 270 top
XTL15  SMD3225-16MHZ 3.2 x 2.5mm crystal  [CRYSTAL-SMD-3X2]  58.67,26.92 270 top
XTL16  SMD3225-16MHZ 3.2 x 2.5mm crystal  [CRYSTAL-SMD-3X2]  58.67,13.46 270 top

## Tracks (layer width: path | path; a pad name or v marks a point on that pad's centre or on a via)
3.3V  (via drill 0.5)
  Top 0.203: 42.67,64.01 44.96,64.01 v46.99,61.98 45.97,61.98 44.96,60.96 44.96,59.44 | 42.67,64.01 39.88,64.01 39.23,63.36 U$29.1 | U$30.1 42.67,63.32 42.67,64.01 | 44.96,59.44 C61.1 | IC18.5 44.96,59.44
  Top 0.254: R59.2 77.22,26.25 77.22,26.16 77.28,26.16 U$34.5 77.28,22.16 77.22,22.1 | U$34.3 79.18,21.66 78.74,22.1 77.22,22.1 | 77.22,22.1 C40.1 | R83.2 39.23,61.64 U$29.1 | R84.2 42.78,61.64 U$30.1
  Top 0.406: C39.1 51.03,87.66 52.07,86.61 v55.37,86.61
  Top 0.61: v75.69,28.45 77.89,26.25 R59.2
  Route15 0.406: v55.37,86.61 49.78,81.03 49.78,76.71 51.05,75.44 51.05,74.17 46.99,70.1 v46.99,61.98
  Bottom 0.203: U$26.1 U$26.12 46.23,30.73 46.48,30.99 53.59,30.99 54.36,30.23 58.42,30.23 | 43.94,43.94 43.69,44.2 43.69,46.23 | Q36.1 44.08,48.91 43.69,48.51 43.69,46.23 | 43.69,46.23 44.49,46.23 | Q40.1 76.6,21.48 75.95,20.83 75.95,19.05 76.57,18.43 Q39.1 | C62.1 31.66,5.36 IC19.4 IC19.5 30.99,5.59 30.73,5.84 29.75,5.84 R86.2 | U$31.1 26.81,8.27 26.16,7.62 26.16,5.51 U$32.1
  Bottom 0.254: R80.2 53.93,7.51 Q42.1 52.69,7.51 52.07,8.13 51.05,8.13 49.02,10.16 49.02,11.43 50.04,12.45 51.49,12.45 | Q36.1 45.8,49.16 R21.2 | R20.2 45.8,46.12 Q35.1 44.49,46.23 | R78.2 78.06,21.48 Q40.1 76.38,21.84 69.34,21.84 68.83,22.35 | R77.2 78.06,18.43 Q39.1 | X6.4 59.78,8.64 58.67,8.64 56.92,10.39 R79.2 54.44,10.56 Q41.1 51.49,12.45 | 51.49,12.45 51.56,12.45 | X1.5 54.87,46.22 54.61,46.48 49.02,46.48 46.48,43.94 43.94,43.94 | R85.2 28.28,8.27 U$31.1 | R86.2 28.28,4.71 U$32.1 | C62.1 36.6,5.36 40.64,9.4 44.7,9.4 48.26,12.95 48.26,18.8 48.94,19.48 X2.2
  Bottom 0.305: 57.1,19.48 C59.A
  Bottom 0.406: 73.17,28.45 X4.6 | P14.4 55.37,83.88 v55.37,86.61 | v46.99,61.98 61.21,47.75 61.21,44.2 57.66,40.64
  Bottom 0.61: X2.2 55.12,19.48 | 55.12,19.48 57.1,19.48 | 73.17,28.45 71.12,28.45 68.83,26.16 68.83,22.35 67.06,20.57 64.01,20.57 62.87,19.43 C59.A 57.15,23.11 58.42,24.38 58.42,30.23 58.42,39.88 57.66,40.64 54.87,43.42 X1.5 | X6.4 59.88,10.98 55.12,15.75 55.12,19.48 | X4.6 73.35,28.45 v75.69,28.45
5V  (via drill 0.5)
  Top 0.203: Q11.1 83.71,81.42 83.06,80.77 80.95,80.77 Q12.1 80.15,81.42 79.5,80.77 78.49,80.77 78.23,80.52
  Top 0.254: U$156.3 79.2,36.28 | IC20.21 65.32,80.56 66.04,81.28 66.8,81.28 70.87,77.22 70.87,76.1 R26.2 | U$60.24 17.27,77.41 | 17.27,75.95 16.51,75.18 U$60.25 | 35.31,73.86 35.31,71.88 U$59.25 | 48.77,20.32 49.02,20.07 | R5.2 R4.2 16.99,6.63 16.51,7.11 v16.51,10.16 | 16.26,70.39 R33.2 | IC20.52 54.86,75.83 v54.86,75.69 | 61.45,71.88 v62.48,71.88 | P5.2 73.41,72.64 71.37,72.64 70.87,73.15 70.87,76.17 R26.2 | Q12.1 80.15,82.89 R23.2 | Q11.1 83.71,82.89 R22.2 | LED4.A 77.98,75.93 C55.1 | LED4.A R26.2 | 78.23,80.52 78.23,76.21 LED4.A | U$156.3 79.25,36.36 | U$156.5 77.28,37.66 77.22,37.59 | U$156.3 79.18,37.15 78.74,37.59 77.22,37.59 | 77.22,37.59 C51.1 | C53.1 61.45,71.88 | 61.45,71.88 60.55,72.78 IC20.64
  Top 0.305: 77.34,42.04 78.19,42.04 R75.2 | 17.27,77.41 17.27,75.95 | 35.31,73.86 U$59.24 35.29,76.97 v34.54,77.72 | SW1.6 16.7,60.39 16.51,60.2 16.51,59.44 | 16.51,59.44 SW1.2 | SW2.6 21.78,41.34 21.59,41.15 21.59,40.39 | 21.59,40.39 SW2.2 | SW3.6 16.7,27.62 16.51,27.43 16.51,26.67 | 16.51,26.67 SW3.2 | SW4.6 16.7,14.16 16.51,13.97 16.51,13.21 | 16.51,13.21 SW4.2 | SW5.6 32.95,54.8 32.77,54.61 32.77,53.85 | 32.77,53.85 SW5.2 | SW6.6 38.03,41.34 37.85,41.15 37.85,40.39 | 37.85,40.39 SW6.2 | SW7.6 32.95,27.62 32.77,27.43 32.77,26.67 | 32.77,26.67 SW7.2 | SW8.6 32.95,14.16 32.77,13.97 32.77,13.21 | 32.77,13.21 SW8.2 | SW9.6 62.16,59.88 61.98,59.69 61.98,58.93 | 61.98,58.93 SW9.2 | SW10.6 54.29,34.99 54.1,34.8 54.1,34.04 | 54.1,34.04 SW10.2 | SW11.2 48.77,20.32 49.02,20.57 49.02,21.08 49.21,21.27 SW11.6 51.24,21.27 51.82,21.84 51.82,23.11 54.1,25.4 54.1,34.04 | 49.02,6.86 SW12.2 | SW13.6 78.42,59.88 78.23,59.69 78.23,58.93 | 78.23,58.93 SW13.2 | SW14.6 74.36,46.42 74.17,46.23 74.17,45.47 | 74.17,45.47 SW14.2 | SW15.6 70.55,27.62 70.36,27.43 70.36,26.67 | 70.36,26.67 SW15.2 | SW16.6 70.55,14.16 70.36,13.97 70.36,13.21 | 70.36,13.21 SW16.2 | v21.59,37.34 21.59,40.39 | v16.51,23.62 16.51,26.67 | v32.77,23.37 32.77,26.67 | v37.85,37.34 37.85,40.39 | v16.51,10.16 16.51,13.21 | v32.77,10.16 32.77,13.21 | 49.02,6.86 49.02,7.62 49.21,7.81 SW12.6 51.24,7.81 51.82,8.38 51.82,14.48 | 49.02,6.86 v49.02,3.81 | v70.36,10.16 70.36,13.21 | 49.02,20.07 49.02,17.53 49.78,16.76 50.8,16.76 51.82,15.75 51.82,14.48 | 32.77,53.85 32.77,51.31 33.53,50.55 v36.07,50.55 | 78.23,58.93 v78.23,55.88 | 61.98,58.93 v61.98,55.88 | 74.17,45.47 v74.17,41.91 | 70.36,26.67 v70.36,23.11
  Top 0.305: 16.51,59.44 16.51,56.39 v17.53,55.37 | 51.82,14.48 51.94,14.35 C60.A 53.85,14.61 | U$60.25 16.51,70.87 16.26,70.61 16.26,70.39 | JP4.2 34.54,87.12 33.78,87.88 17.53,87.88 16.51,86.87 16.51,79.5 17.27,78.74 17.27,77.44 U$60.24
  Top 0.406: U$156.5 77.28,41.98 77.34,42.04 | v53.85,16.76 53.85,14.61
  Top 0.61: 77.34,42.04 77.22,41.91 v74.17,41.91
  Route2 0.254: P5.2 73.41,72.64 67.06,72.64 66.29,71.88 v62.48,71.88
  Route2 0.305: v32.77,23.37 34.29,23.37 | 34.29,23.37 35.05,24.13 35.05,34.54 v37.85,37.34 38.35,36.83 39.37,36.83 39.88,37.34 39.88,39.37 38.1,41.15 38.1,43.94 37.08,44.96 37.08,49.53 v36.07,50.55 | 34.29,23.37 35.05,22.61 35.05,10.41 34.29,9.65 33.27,9.65 v32.77,10.16 | v78.23,55.88 76.2,55.88 74.17,53.85 74.17,46.48 76.45,44.2 76.45,42.42 75.95,41.91 v74.17,41.91 74.17,37.08 72.64,35.56 72.64,23.88 71.88,23.11 v70.36,23.11 70.36,13.97 72.64,11.68 72.64,10.16 71.88,9.4 71.12,9.4 v70.36,10.16
  Route15 0.305: v21.59,37.34 22.1,36.83 37.34,36.83 v37.85,37.34 | v32.77,23.37 32.51,23.11 17.02,23.11 v16.51,23.62 | v16.51,10.16 17.27,9.4 32,9.4 v32.77,10.16 39.88,3.05 48.26,3.05 v49.02,3.81 49.78,3.05 50.8,3.05 51.56,3.81 51.56,8.13 52.58,9.14 69.34,9.14 v70.36,10.16 | v61.98,55.88 62.48,55.37 77.72,55.37 v78.23,55.88 78.23,59.94 80.52,62.23 80.52,68.07 77.22,71.37 P5.2 | v17.53,55.37 17.53,53.34 20.32,50.55 v36.07,50.55
  Bottom 0.254: 34.54,79.5 53.85,79.5 54.86,78.49 v54.86,75.69 58.67,75.69 v62.48,71.88
  Bottom 0.305: X1.6 53.62,37.37 52.83,36.58 38.61,36.58 v37.85,37.34 | X2.1 53.85,17.84
  Bottom 0.406: 53.85,17.84 v53.85,16.76 | v34.54,77.72 34.54,79.5 | 34.54,79.5 JP4.2 | C54.1 34.54,79.5
  Bottom 0.61: X4.1 73.26,41 v74.17,41.91
+5V_SYS
  Top 0.254: U$156.4 79.18,39.05 80.01,39.88 80.01,44.96 78.99,45.97 78.65,45.97 R75.1
  Top 0.305: 78.15,46.48 R75.1 77.89,46.4
  Top 0.406: H2.25 86.98,46.99 78.83,46.99 R75.1
  Top 0.61: H2.25 H2.26
AREF
  Top 0.254: IC20.24 65.38,82.8 66.8,82.8 68.83,80.77 69.82,80.77 C14.2 70.82,80.8 U$53.3 71.24,79.11 71.86,78.49 74.93,78.49 76.2,79.76 R32.1
BOTTOM_SCL
  Bottom 0.254: Q42.2 53.93,6.21 R80.1 54.13,6.35 54.13,3.78 55.88,2.03 61.72,2.03 63.75,4.06 63.75,8.42 X6.1
BOTTOM_SDA
  Bottom 0.254: Q41.2 54.44,9.26 | 54.44,9.26 R79.1 | X6.2 62.38,3.46 61.59,2.67 61.47,2.54 56.13,2.54 55.37,3.3 55.37,8.64 54.75,9.26 54.44,9.26
D22_N13_PWR  (via drill 0.5)
  Top 0.254: SW13.4 79.25,57.79 v79.25,56.64 | IC20.51 55.96,77.55 55.12,76.71 54.36,76.71 v53.09,75.44
  Route2 0.254: v79.25,56.64 77.98,57.91 77.98,68.33 76.96,69.34 62.99,69.34 59.44,72.9 55.63,72.9 v53.09,75.44
D23_N14_PWR  (via drill 0.5)
  Top 0.203: 55.6,77.96 IC20.50
  Top 0.254: SW14.4 75.18,44.33 v75.18,43.18 | 55.6,77.96 54.86,77.22 v53.59,77.22
  Route2 0.254: v75.18,43.18 73.41,44.96 73.41,54.86 72.9,55.37 70.61,55.37 69.34,56.64 69.34,67.82 68.33,68.83 62.74,68.83 59.18,72.39 54.1,72.39 52.07,74.42 52.07,76.71 52.58,77.22 v53.59,77.22
D24_N15_PWR  (via drill 0.5)
  Top 0.203: 55.22,78.33 IC20.49
  Top 0.254: SW15.4 71.37,25.54 v71.37,24.38 | v52.58,78.23 55.15,78.23 IC20.49
  Route2 0.254: v71.37,24.38 70.36,25.4 70.36,34.29 72.9,36.83 72.9,54.36 72.39,54.86 70.36,54.86 68.83,56.39 68.83,60.45 67.31,61.98 67.31,67.56 66.55,68.33 62.48,68.33 58.93,71.88 53.85,71.88 51.56,74.17 51.56,77.22 v52.58,78.23
D25_N16_PWR  (via drill 0.5)
  Top 0.254: SW16.4 71.37,12.07 v71.37,10.92 | v50.8,77.98 52.07,79.25 55.15,79.25 IC20.48
  Route2 0.254: v71.37,10.92 69.09,13.21 69.09,33.78 72.39,37.08 72.39,53.85 71.88,54.36 70.1,54.36 68.33,56.13 68.33,60.2 66.8,61.72 66.8,67.31 66.29,67.82 62.23,67.82 58.67,71.37 53.59,71.37 51.05,73.91 51.05,77.72 v50.8,77.98
D26_N9_PWR  (via drill 0.5)
  Top 0.254: IC20.47 55.35,79.76 51.82,79.76 51.05,78.99 49.53,78.99 v48.77,78.23 | SW9.4 62.99,57.79 v62.99,56.64
  Route2 0.254: v62.99,56.64 61.98,57.66 61.98,67.31 58.42,70.87 53.34,70.87 50.55,73.66 50.55,76.45 v48.77,78.23
D27_N10_PWR  (via drill 0.5)
  Top 0.254: IC20.46 55.55,80.26 51.56,80.26 50.8,79.5 47.5,79.5 46.74,78.74 v46.74,77.22 | SW10.4 55.12,32.9 v55.12,31.75
  Route2 0.254: v55.12,31.75 54.1,32.77 54.1,46.48 56.9,49.28 56.9,54.36 55.88,55.37 53.59,55.37 50.8,58.17 50.8,61.72 45.21,67.31 45.21,75.69 v46.74,77.22
D28_N11_PWR  (via drill 0.5)
  Top 0.254: IC20.45 55.75,80.77 51.31,80.77 50.55,80.01 47.24,80.01 v45.47,78.23 | SW11.4 50.04,19.19 v50.04,18.03
  Route2 0.254: v50.04,18.03 49.02,19.05 49.02,27.43 53.59,32 53.59,46.74 56.39,49.53 56.39,54.1 55.63,54.86 53.34,54.86 50.29,57.91 50.29,61.47 44.7,67.06 44.7,75.95 45.47,76.71 v45.47,78.23
D29_N12_PWR  (via drill 0.5)
  Top 0.254: SW12.4 50.04,5.72 v50.04,4.57 | IC20.44 55.95,81.28 51.05,81.28 50.29,80.52 46.48,80.52 44.2,78.23 v44.2,77.22
  Route2 0.254: v50.04,4.57 49.02,5.59 49.02,14.73 48.01,15.75 48.01,27.18 53.09,32.26 53.09,46.99 55.88,49.78 55.88,53.85 55.37,54.36 53.09,54.36 49.78,57.66 49.78,61.21 44.2,66.8 v44.2,77.22
D30_N5_PWR  (via drill 0.5)
  Top 0.254: SW5.4 33.97,52.14 v34.54,51.56 | IC20.42 56.85,81.79 50.8,81.79 50.04,81.03 45.97,81.03 v43.18,78.23
  Route2 0.254: v34.54,51.56 41.15,58.17 41.15,70.87 43.18,72.9 v43.18,78.23
D31_N6_PWR  (via drill 0.5)
  Top 0.254: SW6.4 38.86,39.25 v38.86,38.1 | IC20.41 57.05,82.3 50.55,82.3 49.78,81.53 44.96,81.53 42.16,78.74 v42.16,77.22
  Route2 0.254: v38.86,38.1 37.08,39.88 37.08,43.69 36.07,44.7 36.07,48.51 33.27,51.31 33.27,52.32 33.78,52.83 35.05,52.83 40.64,58.42 40.64,71.12 42.42,72.9 42.42,76.2 42.16,76.45 v42.16,77.22
D32_N7_PWR  (via drill 0.5)
  Top 0.254: SW7.4 33.78,25.54 v33.78,24.38 | IC20.40 57.25,82.8 50.29,82.8 49.53,82.04 44.2,82.04 40.89,78.74 v40.89,78.23
  Route2 0.254: v33.78,24.38 32.77,25.4 32.77,34.29 36.58,38.1 36.58,43.43 35.56,44.45 35.56,48.26 32.77,51.05 32.77,52.58 33.53,53.34 34.8,53.34 40.13,58.67 40.13,71.37 41.91,73.15 41.91,75.95 40.89,76.96 v40.89,78.23
D33_N8_PWR  (via drill 0.5)
  Top 0.254: SW8.4 33.78,12.07 v33.78,10.92 | IC20.39 57.45,83.31 50.04,83.31 49.28,82.55 43.69,82.55 39.88,78.74 v39.88,77.22
  Route2 0.254: v33.78,10.92 32.77,11.94 32.77,20.83 31.75,22.1 31.75,34.04 36.07,38.35 36.07,43.18 35.05,44.2 35.05,48.01 32.26,50.8 32.26,52.83 33.27,53.85 34.54,53.85 39.62,58.93 39.62,71.63 41.4,73.41 41.4,75.69 v39.88,77.22
D34_N1_PWR  (via drill 0.5)
  Top 0.254: IC20.38 57.65,83.82 49.78,83.82 49.02,83.06 43.43,83.06 41.4,81.03 19.05,81.03 v18.03,80.01 | SW1.4 17.53,58.3 v17.53,57.15
  Route2 0.254: v17.53,57.15 16.76,57.91 16.76,78.74 v18.03,80.01
D35_N2_PWR  (via drill 0.5)
  Top 0.254: IC20.37 57.85,84.33 49.53,84.33 48.77,83.57 43.18,83.57 41.15,81.53 v17.78,81.53 | SW2.4 22.61,39.25 v22.61,38.1
  Route2 0.254: v22.61,38.1 21.59,39.12 21.59,48.01 16.26,53.34 16.26,80.01 v17.78,81.53
D36_N3_PWR  (via drill 0.5)
  Top 0.254: IC20.36 58.05,84.84 49.28,84.84 48.51,84.07 42.93,84.07 40.89,82.04 19.56,82.04 v18.8,82.8 | SW3.4 17.53,25.54 v17.53,24.38
  Route2 0.254: v17.53,24.38 16,25.91 16,33.78 21.08,38.86 21.08,47.75 15.75,53.09 15.75,81.03 17.53,82.8 v18.8,82.8
D37_N4_PWR  (via drill 0.5)
  Top 0.254: SW4.4 17.53,12.07 v17.53,10.92 | IC20.35 58.24,85.34 49.02,85.34 48.26,84.58 42.67,84.58 40.64,82.55 21.34,82.55 19.56,84.33 v18.03,84.33
  Route2 0.254: v17.53,10.92 15.49,12.95 15.49,34.04 20.57,39.12 20.57,47.5 15.24,52.83 15.24,81.53 v18.03,84.33
GEIGER_SCL
  Bottom 0.254: Q36.2 45.8,47.86 R21.1 | X1.1 59.94,45.08 59.94,48.01 58.93,49.02 55.88,49.02 54.36,47.5 46.48,47.5 45.95,48.03 R21.1 | 46,48.01 R21.1
GEIGER_SDA
  Bottom 0.254: Q35.2 45.8,44.82 R20.1 46.51,44.99 48.51,46.99 54.61,46.99 56.13,48.51 57.66,48.51 58.67,47.5 58.67,45.05 X1.2
GND  (via drill 0.5)
  Top 0.203: U$59.12 33.79,68.85 33.27,68.33 | IC18.2 41.15,59.44 | IC18.2 41.66,59.44 41.91,59.18 41.91,58.93 | 41.91,58.93 42.3,58.93 IC18.4 | 41.91,58.93 41.91,58.17 | IC18.2 40.39,59.44
  Top 0.254: 65.53,81.53 64.91,80.91 IC20.22 62.94,78.95 IC20.TGND2 | v10.16,63.5 v10.16,64.77 9.89,64.5 IC1.3 7.89,64.5 7.62,64.77 7.62,66.02 RN1.1 | IC1.5 v10.16,63.5 | IC1.21 12.19,64 v11.68,63.5 | v11.68,64.77 v11.68,63.5 | v10.16,63.5 v11.68,63.5 | v15.24,44.45 v15.24,45.72 14.97,45.45 IC2.3 12.97,45.45 12.7,45.72 12.7,46.97 RN2.1 | IC2.5 v15.24,44.45 | IC2.21 17.27,44.95 v16.76,44.45 | v16.76,45.72 v16.76,44.45 | v15.24,44.45 v16.76,44.45 | v10.16,30.73 v10.16,32 9.89,31.74 IC3.3 7.89,31.74 7.62,32 7.62,33.26 RN3.1 | IC3.5 v10.16,30.74 v10.16,30.73 | IC3.21 12.19,31.24 v11.68,30.73 | v11.68,32 v11.68,30.73 | v10.16,30.73 v11.68,30.73 | v10.16,17.27 v10.16,18.54 9.89,18.28 IC4.3 7.89,18.28 7.62,18.54 7.62,19.8 RN4.1 | IC4.5 v10.16,17.28 v10.16,17.27 | IC4.21 12.19,17.78 v11.68,17.27 | v11.68,18.54 v11.68,17.27 | v10.16,17.27 v11.68,17.27 | v26.42,57.91 v26.42,59.18 26.15,58.92 IC5.3 24.14,58.92 23.88,59.18 23.88,60.44 RN5.1 | IC5.5 v26.41,57.92 v26.42,57.91 | IC5.21 28.44,58.42 v27.94,57.91 | v27.94,59.18 v27.94,57.91 | v26.42,57.91 v27.94,57.91 | v31.5,44.45 v31.5,45.72 31.23,45.45 IC6.3 29.22,45.45 28.96,45.72 28.96,46.97 RN6.1 | IC6.5 v31.49,44.45 v31.5,44.45 | IC6.21 33.52,44.95 v33.02,44.45 | v33.02,45.72 v33.02,44.45 | v31.5,44.45 v33.02,44.45 | v26.42,30.73 v26.42,32 26.15,31.74 IC7.3 24.14,31.74 23.88,32 23.88,33.26 RN7.1 | IC7.5 v26.41,30.74 v26.42,30.73 | IC7.21 28.44,31.24 v27.94,30.73 | v27.94,32 v27.94,30.73 | v26.42,30.73 v27.94,30.73 | v26.42,17.27 v26.42,18.54 26.15,18.28 IC8.3 24.14,18.28 23.88,18.54 23.88,19.8 RN8.1 | IC8.5 v26.41,17.28 v26.42,17.27 | IC8.21 28.44,17.78 v27.94,17.27
  Top 0.254: v27.94,18.54 v27.94,17.27 | v26.42,17.27 v27.94,17.27 | v55.63,62.99 v55.63,64.26 55.36,64 IC9.3 53.35,64 53.09,64.26 53.09,65.52 RN9.1 | IC9.5 v55.62,63 v55.63,62.99 | IC9.21 57.65,63.5 v57.15,62.99 | v57.15,64.26 v57.15,62.99 | v55.63,62.99 v57.15,62.99 | v47.75,38.1 v47.75,39.37 47.49,39.1 IC10.3 45.48,39.1 45.21,39.37 45.21,40.62 RN10.1 | IC10.5 v47.75,38.1 | IC10.21 49.78,38.6 v49.28,38.1 | v49.28,39.37 v49.28,38.1 | v47.75,38.1 v49.28,38.1 | v42.67,24.38 v42.67,25.65 42.41,25.39 IC11.3 40.4,25.39 40.13,25.65 40.13,26.91 RN11.1 | IC11.5 v42.67,24.39 v42.67,24.38 | IC11.21 44.7,24.89 v44.2,24.38 | v44.2,25.65 v44.2,24.38 | v42.67,24.38 v44.2,24.38 | v42.67,10.92 v42.67,12.19 42.41,11.93 IC12.3 40.4,11.93 40.13,12.19 40.13,13.45 RN12.1 | IC12.5 v42.67,10.93 v42.67,10.92 | IC12.21 44.7,11.43 v44.2,10.92 | v44.2,12.19 v44.2,10.92 | v42.67,10.92 v44.2,10.92 | v71.88,62.99 v71.88,64.26 71.62,64 IC13.3 69.61,64 69.34,64.26 69.34,65.52 RN15.1 | IC13.5 v71.88,63 v71.88,62.99 | IC13.21 73.91,63.5 v73.41,62.99 | v73.41,64.26 v73.41,62.99 | v71.88,62.99 v73.41,62.99 | v67.82,49.53 v67.82,50.8 67.55,50.53 IC14.3 65.54,50.53 65.28,50.8 65.28,52.05 RN16.1 | IC14.5 v67.81,49.53 v67.82,49.53 | IC14.21 69.85,50.03 v69.34,49.53 | v69.34,50.8 v69.34,49.53 | v67.82,49.53 v69.34,49.53 | v64.01,30.73 v64.01,32 63.74,31.74 IC15.3 61.73,31.74 61.47,32 61.47,33.26 RN17.1 | IC15.5 v64,30.74 v64.01,30.73 | IC15.21 66.04,31.24 v65.53,30.73 | v65.53,32 v65.53,30.73 | v64.01,30.73 v65.53,30.73 | v64.01,17.27 v64.01,18.54 63.74,18.28 IC16.3 61.73,18.28 61.47,18.54 61.47,19.8 RN18.1 | IC16.5 v64,17.28 v64.01,17.27 | IC16.21 66.04,17.78 v65.53,17.27
  Top 0.254: v65.53,18.54 v65.53,17.27 | v64.01,17.27 v65.53,17.27 | IC20.TGND3 IC20.TGND2 | IC20.TGND3 | IC20.TGND3 IC20.TGND4 v58.93,78.74 | IC20.TGND1 | IC20.TGND1 IC20.TGND2 | IC20.TGND1 60.91,76.76 v58.93,78.74 | IC20.53 58.48,78.74 v58.93,78.74 | IC20.TGND1 v60.96,76.71 60.96,76.45 59.94,75.44 59.94,75.16 60.96,74.14 IC20.63 59.94,73.13 59.94,72.39 | C13.1 73.96,80.8 U$53.4 | C14.1 70.82,81.76 U$53.2 | v56.64,47.24 56.39,47.24 | XTL9.4 51.05,60.19
  Bottom 0.203: U$26.6 46.23,26.67 | IC19.2 30.99,7.37
  Bottom 0.254: X1.3 57.37,46.51 v56.64,47.24
  other vias: 25.65,85.34 2.03,75.44 1.91,77.47 27.69,85.34 52.83,29.21 46.74,17.02 73.91,24.38 60.96,80.77 62.99,78.74 74.93,79.76 55.88,12.95
  pour Bottom: 0,86.3 arc-90 3,89.3 9,89.3 11.2,90.3 79.56,90.3 86.64,85.6 92.45,85.6 arc-90 95.45,82.6 95.45,76.74 93.55,72.91 93.55,16.05 95.45,12.31 95.45,5.08 arc-90 92.45,2.3 75.83,2.3 71.54,0 10.16,0 7.81,1 3,1 arc-90 0,4
  pour Top: 0,86.3 arc-90 3,89.3 9,89.3 11.2,90.3 79.56,90.3 86.64,85.6 92.45,85.6 arc-90 95.45,82.6 95.45,76.74 93.55,72.91 93.55,16.05 95.45,12.31 95.45,5.08 arc-90 92.45,2.3 75.83,2.3 71.54,0 10.16,0 7.81,1 3,1 arc-90 0,4
  pour Route15: 0,86.3 arc-90 3,89.3 9,89.3 11.2,90.3 79.56,90.3 86.64,85.6 92.45,85.6 arc-90 95.45,82.6 95.45,76.74 93.55,72.91 93.55,16.05 95.45,12.31 95.45,5.08 arc-90 92.45,2.3 75.83,2.3 71.54,0 10.16,0 7.81,1 3,1 arc-90 0,4
  pour Route2: 0,86.3 arc-90 3,89.3 9,89.3 11.2,90.3 79.56,90.3 86.64,85.6 92.45,85.6 arc-90 95.45,82.6 95.45,76.74 93.55,72.91 93.55,16.05 95.45,12.31 95.45,5.08 arc-90 92.45,2.3 75.83,2.3 71.54,0 10.16,0 7.81,1 3,1 arc-90 0,4
N1_5V
  Top 0.203: 16.26,63.25 16.76,63.75 16.76,65.79 | 16.11,68.21 16.76,67.56 16.76,65.79 | 16.08,65.79 16.76,65.79
  Top 0.254: 13.99,62.5 IC1.18 12.47,62.5 12.19,62.23 9.91,62.23 9.13,63 IC1.6 7.86,63 7.62,63.25 7.62,63.75 7.75,63.88 | LED1.6 LED1.5 4.32,64.52 4.57,64.77 6.86,64.77 7.75,63.88 | IC1.4 7.87,64 7.75,63.88 | 15.86,68.21 Q2.1 | 15.86,65.67 Q1.1 | H3.2 14.22,58.72 14.22,59.94 14.67,60.39 SW1.1 15.24,60.46 | Q2.1 15.79,68.04 R6.2 14.45,68.33 R1.2 | R3.2 15.79,65.5 Q1.1 | IC1.20 13.97,63.5 | Q2.1 16.11,68.21 | Q1.1 16.08,65.79 | 15.27,62.2 15.24,62.23
  Top 0.305: 13.99,62.5 14.22,62.74 14.22,63.25 | 13.97,63.5 14.22,63.25 | 16.26,63.25 15.24,63.25 | 15.24,63.25 14.22,63.25 | 15.24,60.46 15.24,62.23 15.24,63.25 | C1.1 15.27,62.2
N1_A4_SDA
  Top 0.254: IC1.27 11.67,66.79 11.94,67.06 12.95,67.06 14.22,65.79 14.22,64.77 14.45,64.54 R3.1 15.79,64.54 Q1.2
N1_A5_SCL
  Top 0.254: IC1.28 11.17,67.05 11.68,67.56 13.46,67.56 13.97,67.06 14.7,67.06 R6.1 15.79,67.08 Q2.2
N1_D0_RX  (via drill 0.5)
  Top 0.254: IC1.30 10.17,67.81 v9.65,68.33 8.89,68.33 8.71,68.51 RN1.4 | v25.4,71.63 26.44,70.63 U$59.9
  Bottom 0.254: v9.65,68.33 8.64,68.33 7.62,69.34 7.62,77.22 9.91,79.5 14.22,79.5 15.49,78.23 15.49,76.96 19.3,73.15 23.88,73.15 v25.4,71.63
N1_D1_TX  (via drill 0.5)
  Top 0.203: U$60.9 9.67,73.43 8.64,72.39 v8.64,70.1
  Top 0.254: IC1.31 9.67,66.78 9.14,67.31 v8.64,67.31 8.24,66.91 RN1.2
  Route2 0.254: v8.64,70.1 v8.64,67.31
N1_D11_MOSI
  Top 0.203: 11.94,60.2 11.94,58.44
  Top 0.254: IC1.15 12.17,60.43 11.94,60.2 | 11.94,58.44 H3.4
N1_D12_MISO
  Top 0.254: IC1.16 12.67,59.67 H3.1
N1_D13_SCK  (via drill 0.5)
  Top 0.254: v13.72,60.96 13.27,61.4 IC1.17 | v6.6,63.5 5.24,63.5 LED1.4
  Route15 0.254: v6.6,63.5 9.14,60.96 10.92,60.96 | 10.92,60.96 v13.72,60.96 | H3.3 10.92,60.96
N1_RESET  (via drill 0.5)
  Top 0.254: R1.1 11.44,68.33 v11.18,68.33 10.67,67.82 IC1.29
  Route2 0.254: v11.18,68.33 8.92,66.07 H3.5
N2_5V
  Top 0.203: 21.34,44.2 21.84,44.7 21.84,46.74 | 21.19,49.16 21.84,48.51 21.84,46.74 | 21.16,46.74 21.84,46.74
  Top 0.254: 19.07,43.45 IC2.18 17.55,43.45 17.27,43.18 14.99,43.18 14.21,43.95 IC2.6 12.94,43.95 12.7,44.2 12.7,44.7 12.83,44.83 | LED2.6 LED2.5 9.4,45.47 9.65,45.72 11.94,45.72 12.83,44.83 | IC2.4 12.95,44.95 12.83,44.83 | 20.94,49.16 Q4.1 | 20.94,46.62 Q3.1 | H4.2 19.3,39.67 19.3,40.89 19.75,41.34 SW2.1 20.32,41.41 | Q4.1 20.87,48.99 R11.2 19.53,49.28 R7.2 | R9.2 20.87,46.45 Q3.1 | IC2.20 19.05,44.45 | Q4.1 21.19,49.16 | Q3.1 21.16,46.74 | 20.35,43.15 20.32,43.18
  Top 0.305: 19.07,43.45 19.3,43.69 19.3,44.2 | 19.05,44.45 19.3,44.2 | 21.34,44.2 20.32,44.2 | 20.32,44.2 19.3,44.2 | 20.32,41.41 20.32,43.18 20.32,44.2 | C6.1 20.35,43.15
N2_A4_SDA
  Top 0.254: IC2.27 16.75,47.74 17.02,48.01 18.03,48.01 19.3,46.74 19.3,45.72 19.53,45.49 R9.1 20.87,45.49 Q3.2
N2_A5_SCL
  Top 0.254: IC2.28 16.25,48 16.76,48.51 18.54,48.51 19.05,48.01 19.78,48.01 R11.1 20.87,48.03 Q4.2
N2_D0_RX  (via drill 0.5)
  Top 0.254: IC2.30 15.25,48.76 v14.73,49.28 13.97,49.28 13.79,49.46 RN2.4 | v26.67,72.39 27.95,71.13 U$59.8
  Bottom 0.254: v14.73,49.28 8.64,49.28 7.62,50.29 7.62,64.52 7.11,65.02 7.11,77.47 9.65,80.01 14.48,80.01 16,78.49 16,77.22 19.56,73.66 25.4,73.66 v26.67,72.39
N2_D1_TX  (via drill 0.5)
  Top 0.203: U$60.8 6.36,73.93 5.08,72.64 v5.08,70.36
  Top 0.254: IC2.31 14.75,47.73 14.22,48.26 v13.72,48.26 13.32,47.86 RN2.2
  Route2 0.254: v5.08,70.36 5.08,49.28 6.1,48.26 v13.72,48.26
N2_D11_MOSI
  Top 0.203: 17.02,41.15 17.02,39.39
  Top 0.254: IC2.15 17.25,41.38 17.02,41.15 | 17.02,39.39 H4.4
N2_D12_MISO
  Top 0.254: IC2.16 17.75,40.62 H4.1
N2_D13_SCK  (via drill 0.5)
  Top 0.254: v18.8,41.91 18.35,42.35 IC2.17 | v11.68,44.45 10.32,44.45 LED2.4
  Route15 0.254: v11.68,44.45 14.22,41.91 16,41.91 | 16,41.91 v18.8,41.91 | H4.3 16,41.91
N2_RESET  (via drill 0.5)
  Top 0.254: R7.1 16.52,49.28 v16.26,49.28 15.75,48.77 IC2.29
  Route2 0.254: v16.26,49.28 14,47.02 H4.5
N3_5V
  Top 0.203: 16.26,30.48 16.76,30.99 16.76,33.02 | 16.11,35.45 16.76,34.8 16.76,33.02 | 16.08,33.02 16.76,33.02
  Top 0.254: 13.99,29.74 IC3.18 12.47,29.74 12.19,29.46 9.91,29.46 9.13,30.24 IC3.6 7.86,30.24 7.62,30.48 7.62,30.99 7.75,31.11 | LED3.6 LED3.5 4.32,31.75 4.57,32 6.86,32 7.75,31.11 | IC3.4 7.87,31.24 7.75,31.11 | 15.86,35.45 Q6.1 | 15.86,32.91 Q5.1 | H5.2 14.22,25.96 14.22,27.18 14.67,27.62 SW3.1 15.24,27.69 | Q6.1 15.79,35.28 R15.2 14.45,35.56 R12.2 | R14.2 15.79,32.74 Q5.1 | IC3.20 13.97,30.74 | Q6.1 16.11,35.45 | Q5.1 16.08,33.02 | 15.27,29.44 15.24,29.46
  Top 0.305: 13.99,29.74 14.22,29.97 14.22,30.48 | 13.97,30.74 14.22,30.48 | 16.26,30.48 15.24,30.48 | 15.24,30.48 14.22,30.48 | 15.24,27.69 15.24,29.46 15.24,30.48 | C9.1 15.27,29.44
N3_A4_SDA
  Top 0.254: IC3.27 11.67,34.02 11.94,34.29 12.95,34.29 14.22,33.02 14.22,32 14.45,31.78 R14.1 15.79,31.78 Q5.2
N3_A5_SCL
  Top 0.254: IC3.28 11.17,34.29 11.68,34.8 13.46,34.8 13.97,34.29 14.7,34.29 R15.1 15.79,34.32 Q6.2
N3_D0_RX  (via drill 0.5)
  Top 0.254: IC3.30 10.17,35.04 v9.65,35.56 8.89,35.56 8.71,35.74 RN3.4 | v27.94,73.15 29.47,71.63 U$59.7
  Bottom 0.254: v9.65,35.56 9.65,47.5 7.11,50.04 7.11,61.21 5.59,62.74 5.59,64.26 6.6,65.28 6.6,77.72 9.4,80.52 14.73,80.52 16.51,78.74 16.51,77.47 19.81,74.17 26.92,74.17 v27.94,73.15
N3_D1_TX  (via drill 0.5)
  Top 0.203: U$60.7 5.85,74.43 4.06,72.64 v4.06,71.63
  Top 0.254: IC3.31 9.67,34.02 9.14,34.54 v8.64,34.54 8.24,34.14 RN3.2
  Route2 0.254: v4.06,71.63 4.06,49.53 5.84,47.75 8.38,47.75 9.91,46.23 9.91,37.85 8.64,36.58 v8.64,34.54
N3_D11_MOSI
  Top 0.203: 11.94,27.43 11.94,25.67
  Top 0.254: IC3.15 12.17,27.67 11.94,27.43 | 11.94,25.67 H5.4
N3_D12_MISO
  Top 0.254: IC3.16 12.67,26.9 H5.1
N3_D13_SCK  (via drill 0.5)
  Top 0.254: v13.72,28.19 13.27,28.64 IC3.17 | v6.6,30.73 5.24,30.73 LED3.4
  Route15 0.254: v6.6,30.73 9.14,28.19 10.92,28.19 | 10.92,28.19 v13.72,28.19 | H5.3 10.92,28.19
N3_RESET  (via drill 0.5)
  Top 0.254: R12.1 11.44,35.56 v11.18,35.56 10.67,35.06 IC3.29
  Route2 0.254: v11.18,35.56 8.92,33.31 H5.5
N4_5V
  Top 0.203: 16.26,17.02 16.76,17.53 16.76,19.56 | 16.11,21.99 16.76,21.34 16.76,19.56 | 16.08,19.56 16.76,19.56
  Top 0.254: 13.99,16.28 IC4.18 12.47,16.28 12.19,16 9.91,16 9.13,16.78 IC4.6 7.86,16.78 7.62,17.02 7.62,17.53 7.75,17.65 | LED5.6 LED5.5 4.32,18.29 4.57,18.54 6.86,18.54 7.75,17.65 | IC4.4 7.87,17.78 7.75,17.65 | 15.86,21.99 Q8.1 | 15.86,19.45 Q7.1 | H6.2 14.22,12.49 14.22,13.72 14.67,14.16 SW4.1 15.24,14.23 | Q8.1 15.79,21.82 R19.2 14.45,22.1 R16.2 | R18.2 15.79,19.28 Q7.1 | IC4.20 13.97,17.28 | Q8.1 16.11,21.99 | Q7.1 16.08,19.56 | 15.27,15.97 15.24,16
  Top 0.305: 13.99,16.28 14.22,16.51 14.22,17.02 | 13.97,17.28 14.22,17.02 | 16.26,17.02 15.24,17.02 | 15.24,17.02 14.22,17.02 | 15.24,14.23 15.24,16 15.24,17.02 | C12.1 15.27,15.97
N4_A4_SDA
  Top 0.254: IC4.27 11.67,20.56 11.94,20.83 12.95,20.83 14.22,19.56 14.22,18.54 14.45,18.32 R18.1 15.79,18.32 Q7.2
N4_A5_SCL
  Top 0.254: IC4.28 11.17,20.82 11.68,21.34 13.46,21.34 13.97,20.83 14.7,20.83 R19.1 15.79,20.86 Q8.2
N4_D0_RX  (via drill 0.5)
  Top 0.254: IC4.30 10.17,21.58 v9.65,22.1 8.89,22.1 8.71,22.28 RN4.4 | v29.21,73.91 30.98,72.13 U$59.6
  Bottom 0.254: v9.65,22.1 7.62,24.13 7.62,35.81 9.14,37.34 9.14,47.24 6.6,49.78 6.6,60.96 5.08,62.48 5.08,64.52 6.1,65.53 6.1,77.98 9.14,81.03 14.99,81.03 17.02,78.99 17.02,77.72 20.07,74.68 28.45,74.68 v29.21,73.91
N4_D1_TX  (via drill 0.5)
  Top 0.203: U$60.6 5.58,74.93 3.05,72.39 v3.05,70.36
  Top 0.254: IC4.31 9.67,20.55 9.14,21.08 v8.64,21.08 8.24,20.68 RN4.2
  Route2 0.254: v3.05,70.36 3.05,49.78 5.59,47.24 8.13,47.24 9.4,45.97 9.4,38.1 5.08,33.78 5.08,23.37 7.37,21.08 v8.64,21.08
N4_D11_MOSI
  Top 0.203: 11.94,13.97 11.94,12.21
  Top 0.254: IC4.15 12.17,14.2 11.94,13.97 | 11.94,12.21 H6.4
N4_D12_MISO
  Top 0.254: IC4.16 12.67,13.44 H6.1
N4_D13_SCK  (via drill 0.5)
  Top 0.254: v13.72,14.73 13.27,15.18 IC4.17 | v6.6,17.27 5.24,17.27 LED5.4
  Route15 0.254: v6.6,17.27 9.14,14.73 10.92,14.73 | 10.92,14.73 v13.72,14.73 | H6.3 10.92,14.73
N4_RESET  (via drill 0.5)
  Top 0.254: R16.1 11.44,22.1 v11.18,22.1 10.67,21.59 IC4.29
  Route2 0.254: v11.18,22.1 8.92,19.84 H6.5
N5_5V
  Top 0.203: 32.51,57.66 33.02,58.17 33.02,60.2 | 32.37,62.63 33.02,61.98 33.02,60.2 | 32.33,60.2 33.02,60.2
  Top 0.254: 30.25,56.92 IC5.18 28.72,56.92 28.45,56.64 26.16,56.64 25.39,57.42 IC5.6 24.12,57.42 23.88,57.66 23.88,58.17 24,58.29 | LED6.6 LED6.5 20.57,58.93 20.83,59.18 23.11,59.18 24,58.29 | IC5.4 24.13,58.42 24,58.29 | 32.12,62.63 Q10.1 | 32.12,60.09 Q9.1 | H7.2 30.48,53.13 30.48,54.36 30.92,54.8 SW5.1 31.5,54.87 | Q10.1 32.05,62.46 R28.2 30.71,62.74 R24.2 | R27.2 32.05,59.92 Q9.1 | IC5.20 30.22,57.92 | Q10.1 32.37,62.63 | Q9.1 32.33,60.2 | 31.52,56.61 31.5,56.64
  Top 0.305: 30.25,56.92 30.48,57.15 30.48,57.66 | 30.22,57.92 30.48,57.66 | 32.51,57.66 31.5,57.66 | 31.5,57.66 30.48,57.66 | 31.5,54.87 31.5,56.64 31.5,57.66 | C17.1 31.52,56.61
N5_A4_SDA
  Top 0.254: IC5.27 27.93,61.2 28.19,61.47 29.21,61.47 30.48,60.2 30.48,59.18 30.71,58.96 R27.1 32.05,58.96 Q9.2
N5_A5_SCL
  Top 0.254: IC5.28 27.43,61.46 27.94,61.98 29.72,61.98 30.23,61.47 30.96,61.47 R28.1 32.05,61.5 Q10.2
N5_D0_RX  (via drill 0.5)
  Top 0.254: IC5.30 26.43,62.22 v25.91,62.74 25.15,62.74 24.96,62.92 RN5.4 | U$59.5 31.51,72.63 30.23,73.91 30.23,78.49 29.72,78.99 24.13,78.99 v23.37,78.23
  Route2 0.254: v25.91,62.74 24.13,64.52 24.13,75.18 23.37,75.95 v23.37,78.23
N5_D1_TX  (via drill 0.5)
  Top 0.203: U$60.5 13.22,75.43 v12.7,75.95
  Top 0.254: IC5.31 25.93,61.19 25.4,61.72 v24.89,61.72 24.49,61.32 RN5.2
  Bottom 0.254: v24.89,61.72 20.83,65.79 20.83,67.31 17.27,70.87 11.94,70.87 9.65,72.9 9.65,75.44 10.16,75.95 v12.7,75.95
N5_D11_MOSI
  Top 0.203: 28.19,54.61 28.19,52.85
  Top 0.254: IC5.15 28.43,54.84 28.19,54.61 | 28.19,52.85 H7.4
N5_D12_MISO
  Top 0.254: IC5.16 28.93,54.08 H7.1
N5_D13_SCK  (via drill 0.5)
  Top 0.254: v29.97,55.37 29.53,55.82 IC5.17 | v22.86,57.91 21.49,57.91 LED6.4
  Route15 0.254: v22.86,57.91 25.4,55.37 27.18,55.37 | 27.18,55.37 v29.97,55.37 | H7.3 27.18,55.37
N5_RESET  (via drill 0.5)
  Top 0.254: R24.1 27.69,62.74 v27.44,62.74 26.93,62.23 IC5.29
  Route2 0.254: v27.44,62.74 25.18,60.48 H7.5
N6_5V
  Top 0.203: 37.59,44.2 38.1,44.7 38.1,46.74 | 37.45,49.16 38.1,48.51 38.1,46.74 | 37.41,46.74 38.1,46.74
  Top 0.254: 35.33,43.45 IC6.18 33.8,43.45 33.53,43.18 31.24,43.18 30.47,43.95 IC6.6 29.2,43.95 28.96,44.2 28.96,44.7 29.08,44.83 | LED7.6 LED7.5 25.65,45.47 25.91,45.72 28.19,45.72 29.08,44.83 | IC6.4 29.21,44.95 29.08,44.83 | 37.2,49.16 Q14.1 | 37.2,46.62 Q13.1 | H8.2 35.56,39.67 35.56,40.89 36,41.34 SW6.1 36.58,41.41 | Q14.1 37.13,48.99 R34.2 35.79,49.28 R29.2 | R31.2 37.13,46.45 Q13.1 | IC6.20 35.3,44.45 | Q14.1 37.45,49.16 | Q13.1 37.41,46.74 | 36.6,43.15 36.58,43.18